# Altium project PT-15-V1.0.PrjPcb (part 6 of 7)

## Sheet 14-RTL8367.schdoc
size A1
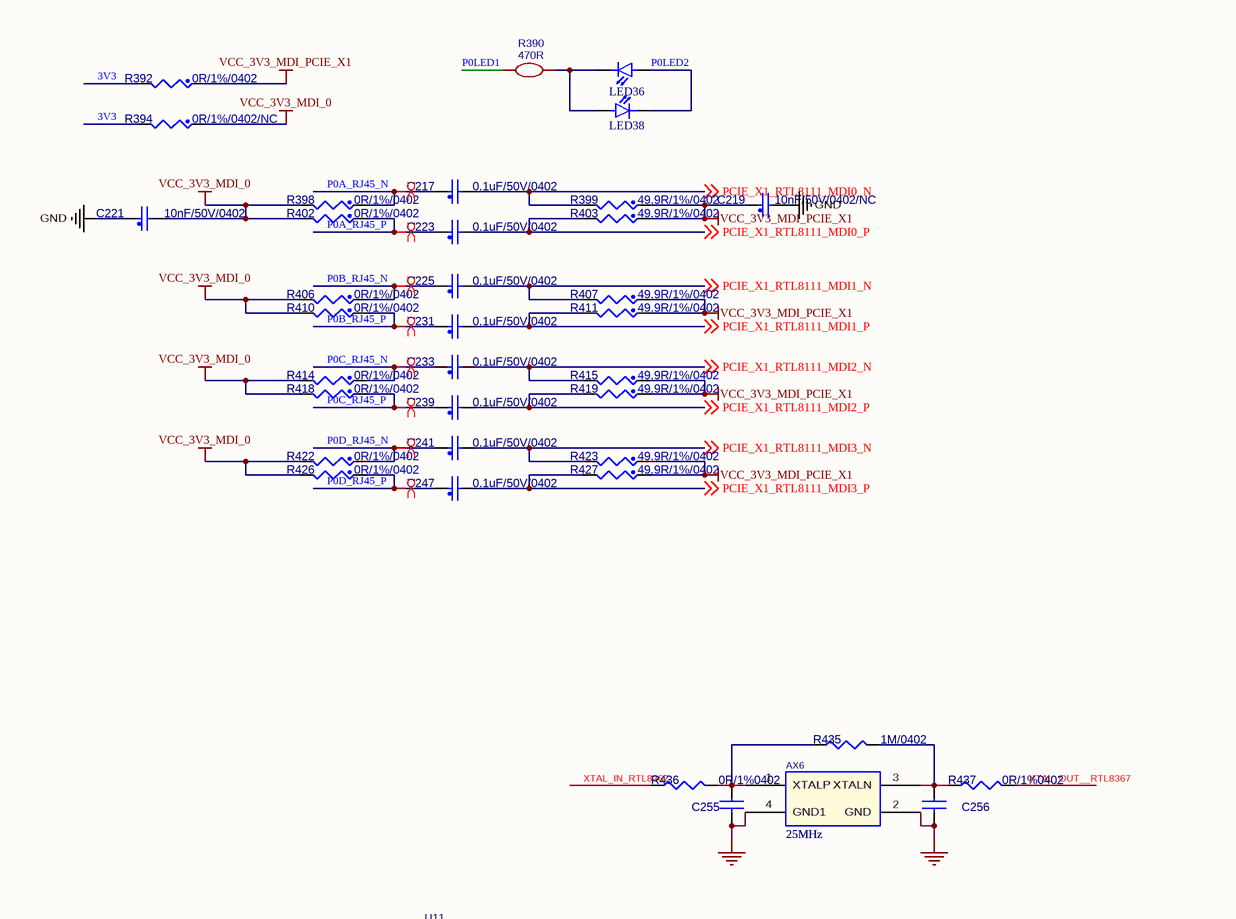
[diagram p20: 14-RTL8367.schdoc, top left]
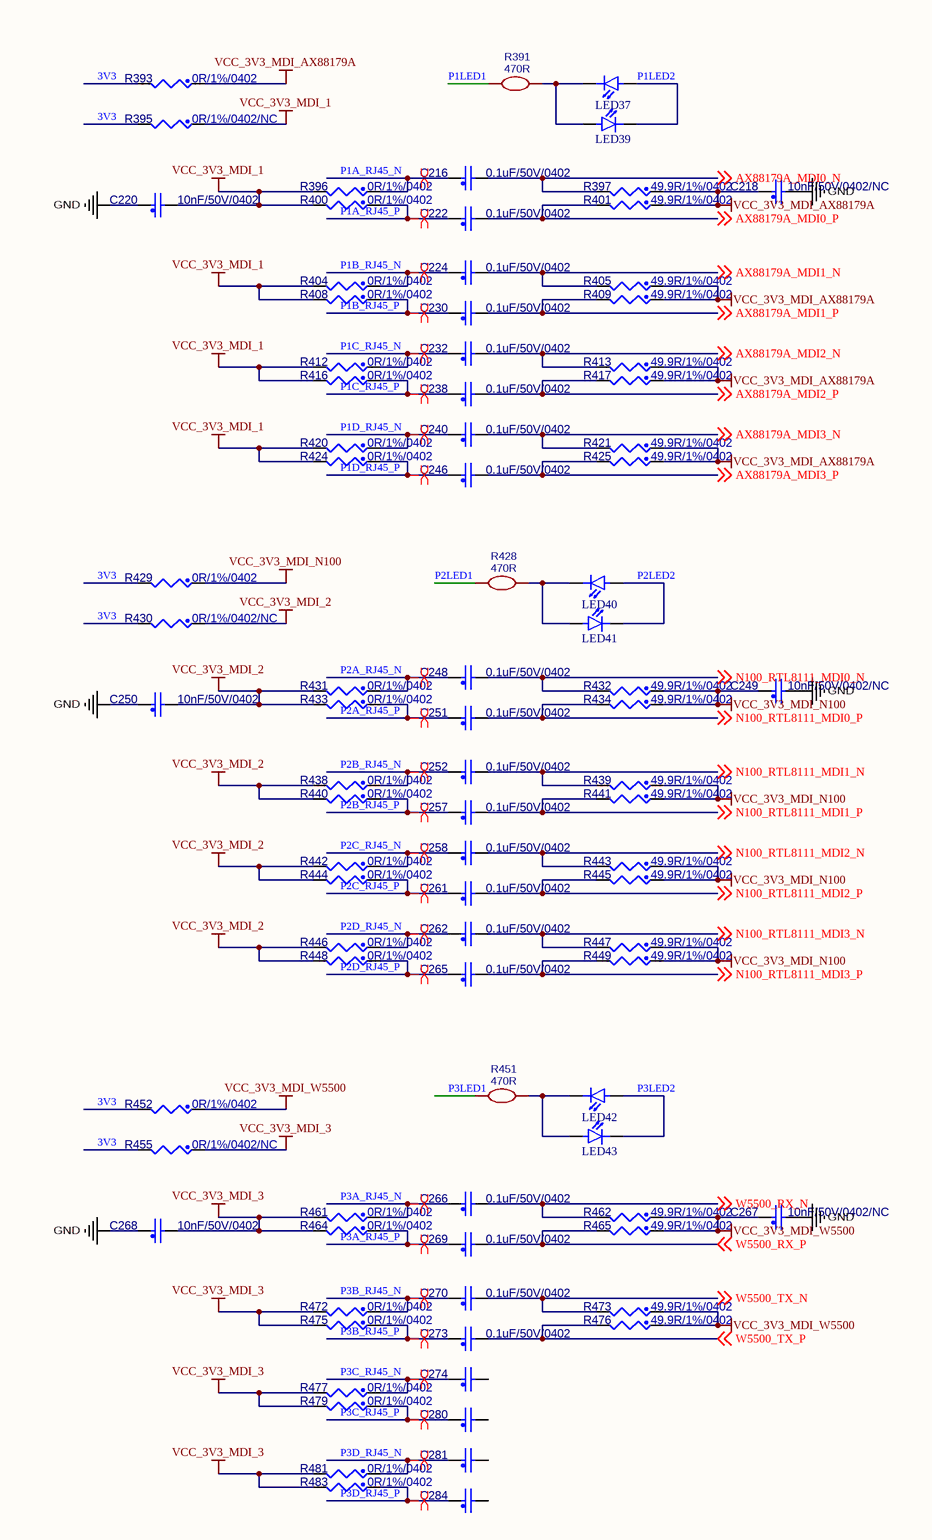
[diagram p21: 14-RTL8367.schdoc, top right]
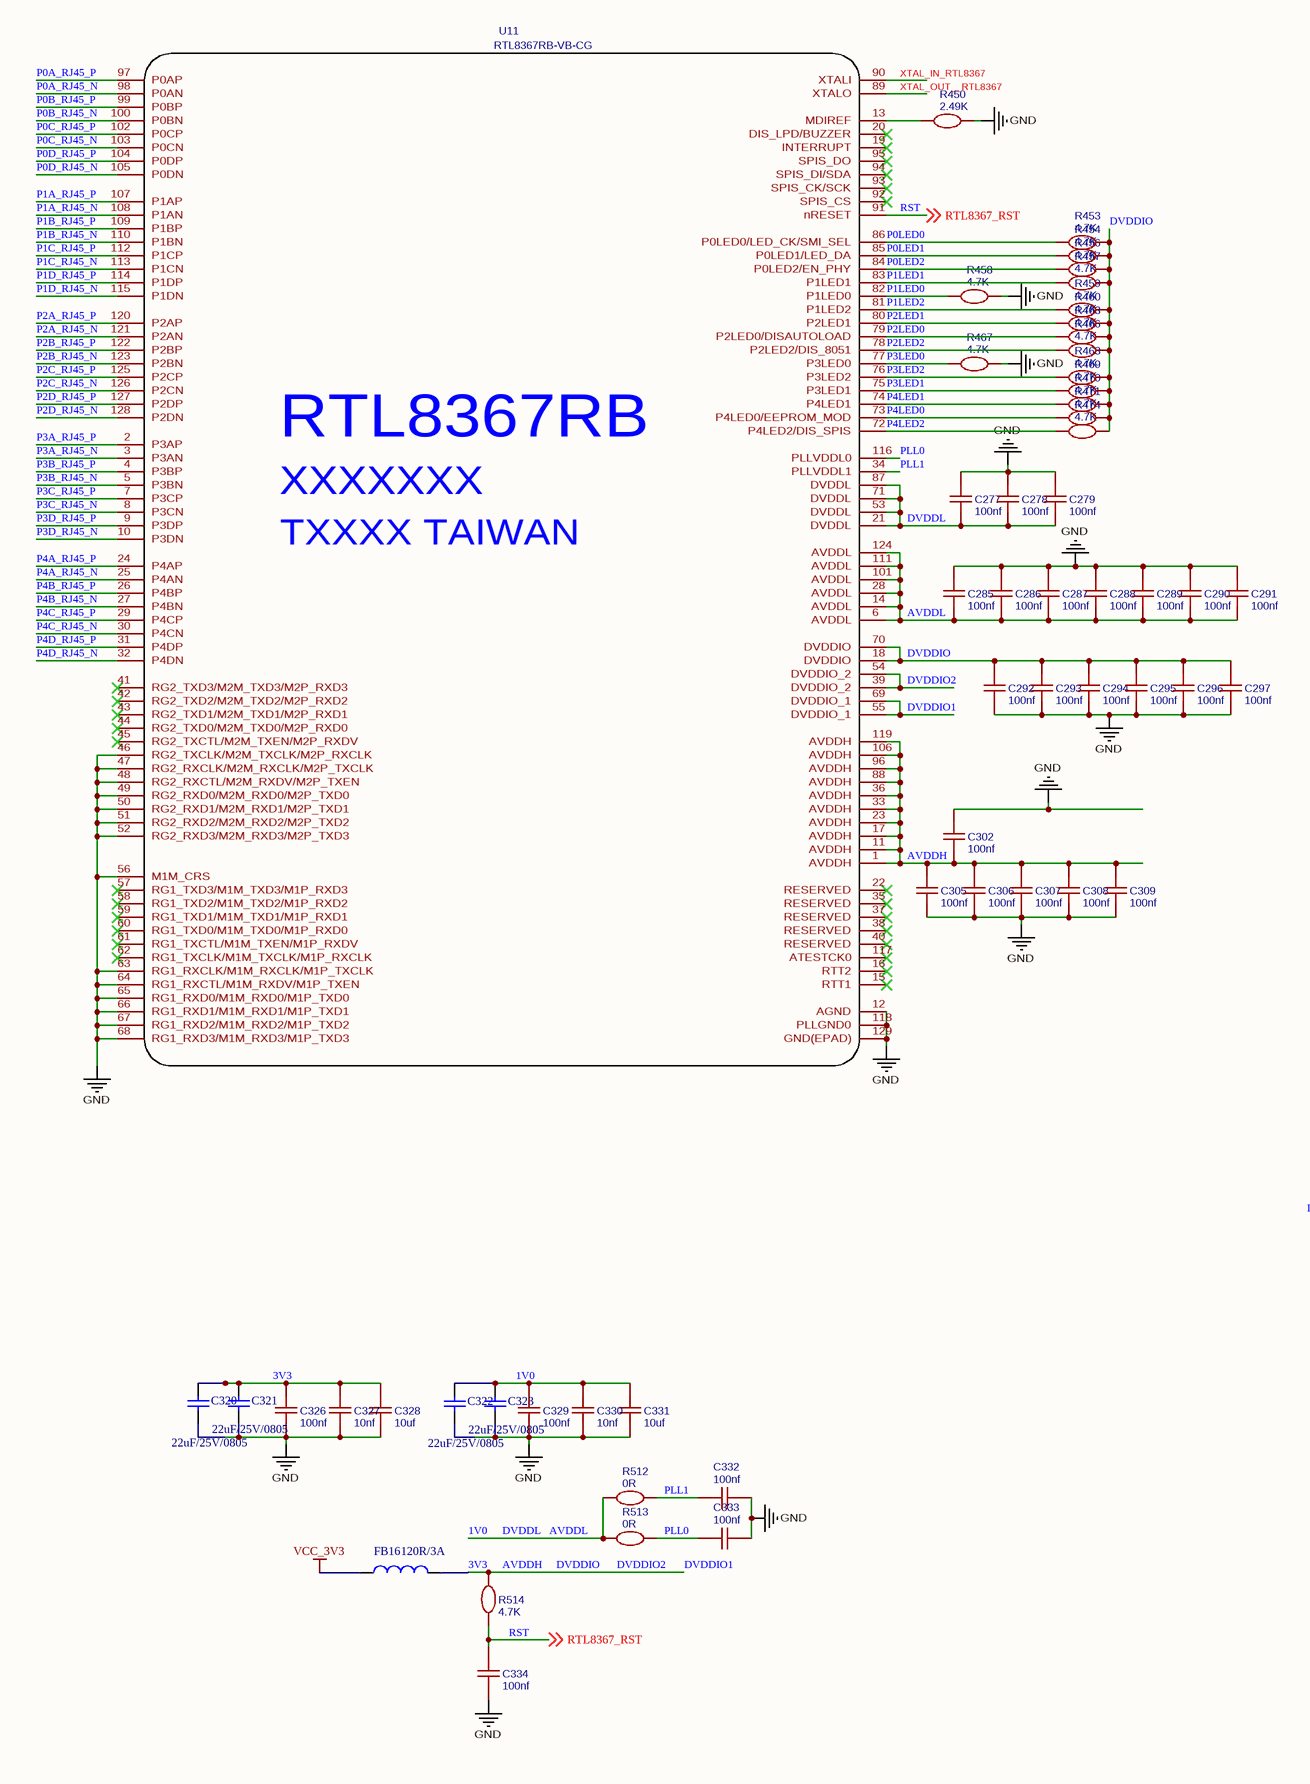
[diagram p22: 14-RTL8367.schdoc, bottom left]
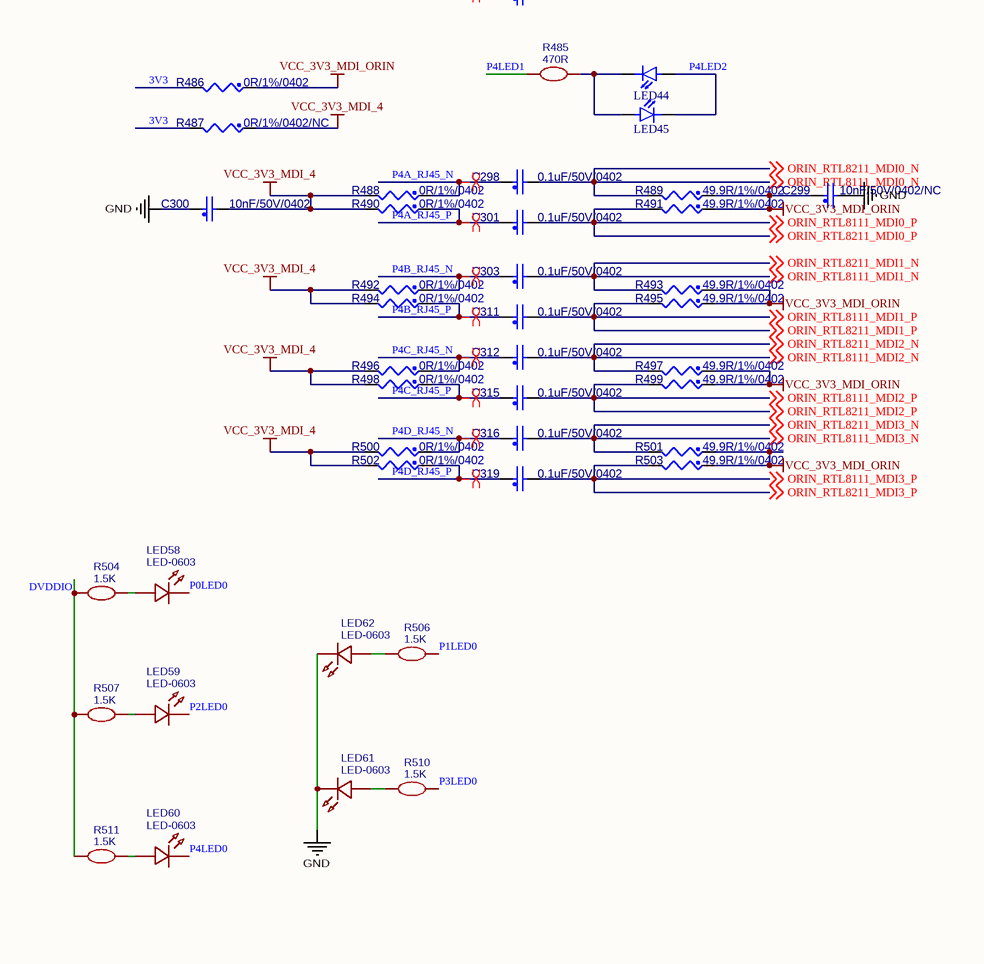
[diagram p23: 14-RTL8367.schdoc, bottom right]

### Parts
(Parts that share a designator on the sheet are numbered #1, #2 ... from top to bottom, then left to right.)
AX6  25MHz  [2016]
C216  value 0.1uF/50V/0402  [C0402]  (hidden comment: CAP_NP)
C217  value 0.1uF/50V/0402  [C0402]  (hidden comment: CAP_NP)
C218  value 10nF/50V/0402/NC  [C0402]  (hidden comment: CAP_NP)
C219  value 10nF/50V/0402/NC  [C0402]  (hidden comment: CAP_NP)
C220  value 10nF/50V/0402  [C0402]  (hidden comment: CAP_NP)
C221  value 10nF/50V/0402  [C0402]  (hidden comment: CAP_NP)
C222  value 0.1uF/50V/0402  [C0402]  (hidden comment: CAP_NP)
C223  value 0.1uF/50V/0402  [C0402]  (hidden comment: CAP_NP)
C224  value 0.1uF/50V/0402  [C0402]  (hidden comment: CAP_NP)
C225  value 0.1uF/50V/0402  [C0402]  (hidden comment: CAP_NP)
C230  value 0.1uF/50V/0402  [C0402]  (hidden comment: CAP_NP)
C231  value 0.1uF/50V/0402  [C0402]  (hidden comment: CAP_NP)
C232  value 0.1uF/50V/0402  [C0402]  (hidden comment: CAP_NP)
C233  value 0.1uF/50V/0402  [C0402]  (hidden comment: CAP_NP)
C238  value 0.1uF/50V/0402  [C0402]  (hidden comment: CAP_NP)
C239  value 0.1uF/50V/0402  [C0402]  (hidden comment: CAP_NP)
C240  value 0.1uF/50V/0402  [C0402]  (hidden comment: CAP_NP)
C241  value 0.1uF/50V/0402  [C0402]  (hidden comment: CAP_NP)
C246  value 0.1uF/50V/0402  [C0402]  (hidden comment: CAP_NP)
C247  value 0.1uF/50V/0402  [C0402]  (hidden comment: CAP_NP)
C248  value 0.1uF/50V/0402  [C0402]  (hidden comment: CAP_NP)
C249  value 10nF/50V/0402/NC  [C0402]  (hidden comment: CAP_NP)
C250  value 10nF/50V/0402  [C0402]  (hidden comment: CAP_NP)
C251  value 0.1uF/50V/0402  [C0402]  (hidden comment: CAP_NP)
C252  value 0.1uF/50V/0402  [C0402]  (hidden comment: CAP_NP)
C255  CAP NP_Dup3  [C0402]  (value not drawn)
C256  CAP NP_Dup3  [C0402]  (value not drawn)
C257  value 0.1uF/50V/0402  [C0402]  (hidden comment: CAP_NP)
C258  value 0.1uF/50V/0402  [C0402]  (hidden comment: CAP_NP)
C261  value 0.1uF/50V/0402  [C0402]  (hidden comment: CAP_NP)
C262  value 0.1uF/50V/0402  [C0402]  (hidden comment: CAP_NP)
C265  value 0.1uF/50V/0402  [C0402]  (hidden comment: CAP_NP)
C266  value 0.1uF/50V/0402  [C0402]  (hidden comment: CAP_NP)
C267  value 10nF/50V/0402/NC  [C0402]  (hidden comment: CAP_NP)
C268  value 10nF/50V/0402  [C0402]  (hidden comment: CAP_NP)
C269  value 0.1uF/50V/0402  [C0402]  (hidden comment: CAP_NP)
C270  value 0.1uF/50V/0402  [C0402]  (hidden comment: CAP_NP)
C273  value 0.1uF/50V/0402  [C0402]  (hidden comment: CAP_NP)
C274  CAP_NP  [C0402]  (value not drawn)
C277  100nf  [C0402]
C278  100nf  [C0402]
C279  100nf  [C0402]
C280  CAP_NP  [C0402]  (value not drawn)
C281  CAP_NP  [C0402]  (value not drawn)
C284  CAP_NP  [C0402]  (value not drawn)
C285  100nf  [C0402]
C286  100nf  [C0402]
C287  100nf  [C0402]
C288  100nf  [C0402]
C289  100nf  [C0402]
C290  100nf  [C0402]
C291  100nf  [C0402]
C292  100nf  [C0402]
C293  100nf  [C0402]
C294  100nf  [C0402]
C295  100nf  [C0402]
C296  100nf  [C0402]
C297  100nf  [C0402]
C298  value 0.1uF/50V/0402  [C0402]  (hidden comment: CAP_NP)
C299  value 10nF/50V/0402/NC  [C0402]  (hidden comment: CAP_NP)
C300  value 10nF/50V/0402  [C0402]  (hidden comment: CAP_NP)
C301  value 0.1uF/50V/0402  [C0402]  (hidden comment: CAP_NP)
C302  100nf  [C0402]
C303  value 0.1uF/50V/0402  [C0402]  (hidden comment: CAP_NP)
C305  100nf  [C0402]
C306  100nf  [C0402]
C307  100nf  [C0402]
C308  100nf  [C0402]
C309  100nf  [C0402]
C311  value 0.1uF/50V/0402  [C0402]  (hidden comment: CAP_NP)
C312  value 0.1uF/50V/0402  [C0402]  (hidden comment: CAP_NP)
C315  value 0.1uF/50V/0402  [C0402]  (hidden comment: CAP_NP)
C316  value 0.1uF/50V/0402  [C0402]  (hidden comment: CAP_NP)
C319  value 0.1uF/50V/0402  [C0402]  (hidden comment: CAP_NP)
C320  22uF/25V/0805  [C0805]
C321  22uF/25V/0805  [C0805]
C322  22uF/25V/0805  [C0805]
C323  22uF/25V/0805  [C0805]
C326  100nf  [C0402]
C327  10nf  [C0402]
C328  10uf  [C0805]
C329  100nf  [C0402]
C330  10nf  [C0402]
C331  10uf  [C0805]
C332  100nf  [C0402]
C333  100nf  [C0402]
C334  100nf  [C0402]
FB16  120R/3A  [L0603]
LED36  LED_GREEN  [LED0603]  (value not drawn)
LED37  LED_GREEN  [LED0603]  (value not drawn)
LED38  LED_GREEN  [LED0603]  (value not drawn)
LED39  LED_GREEN  [LED0603]  (value not drawn)
LED40  LED_GREEN  [LED0603]  (value not drawn)
LED41  LED_GREEN  [LED0603]  (value not drawn)
LED42  LED_GREEN  [LED0603]  (value not drawn)
LED43  LED_GREEN  [LED0603]  (value not drawn)
LED44  LED_GREEN  [LED0603]  (value not drawn)
LED45  LED_GREEN  [LED0603]  (value not drawn)
LED58  LED-0603  [LED0603]
LED59  LED-0603  [LED0603]
LED60  LED-0603  [LED0603]
LED61  LED-0603  [LED0603]
LED62#1  LED-0603  [LED0603]
R390  470R  [R0402]
R391  470R  [R0402]
R392  value 0R/1%/0402  [R0402]  (hidden comment: RES_Dup2)
R393  value 0R/1%/0402  [R0402]  (hidden comment: RES_Dup2)
R394  value 0R/1%/0402/NC  [R0402]  (hidden comment: RES_Dup2)
R395  value 0R/1%/0402/NC  [R0402]  (hidden comment: RES_Dup2)
R396  value 0R/1%/0402  [R0402]  (hidden comment: RES_Dup2)
R397  value 49.9R/1%/0402  [R0402]  (hidden comment: RES_Dup2)
R398  value 0R/1%/0402  [R0402]  (hidden comment: RES_Dup2)
R399  value 49.9R/1%/0402  [R0402]  (hidden comment: RES_Dup2)
R400  value 0R/1%/0402  [R0402]  (hidden comment: RES_Dup2)
R401  value 49.9R/1%/0402  [R0402]  (hidden comment: RES_Dup2)
R402  value 0R/1%/0402  [R0402]  (hidden comment: RES_Dup2)
R403  value 49.9R/1%/0402  [R0402]  (hidden comment: RES_Dup2)
R404  value 0R/1%/0402  [R0402]  (hidden comment: RES_Dup2)
R405  value 49.9R/1%/0402  [R0402]  (hidden comment: RES_Dup2)
R406  value 0R/1%/0402  [R0402]  (hidden comment: RES_Dup2)
R407  value 49.9R/1%/0402  [R0402]  (hidden comment: RES_Dup2)
R408  value 0R/1%/0402  [R0402]  (hidden comment: RES_Dup2)
R409  value 49.9R/1%/0402  [R0402]  (hidden comment: RES_Dup2)
R410  value 0R/1%/0402  [R0402]  (hidden comment: RES_Dup2)
R411  value 49.9R/1%/0402  [R0402]  (hidden comment: RES_Dup2)
R412  value 0R/1%/0402  [R0402]  (hidden comment: RES_Dup2)
R413  value 49.9R/1%/0402  [R0402]  (hidden comment: RES_Dup2)
R414  value 0R/1%/0402  [R0402]  (hidden comment: RES_Dup2)
R415  value 49.9R/1%/0402  [R0402]  (hidden comment: RES_Dup2)
R416  value 0R/1%/0402  [R0402]  (hidden comment: RES_Dup2)
R417  value 49.9R/1%/0402  [R0402]  (hidden comment: RES_Dup2)
R418  value 0R/1%/0402  [R0402]  (hidden comment: RES_Dup2)
R419  value 49.9R/1%/0402  [R0402]  (hidden comment: RES_Dup2)
R420  value 0R/1%/0402  [R0402]  (hidden comment: RES_Dup2)
R421  value 49.9R/1%/0402  [R0402]  (hidden comment: RES_Dup2)
R422  value 0R/1%/0402  [R0402]  (hidden comment: RES_Dup2)
R423  value 49.9R/1%/0402  [R0402]  (hidden comment: RES_Dup2)
R424  value 0R/1%/0402  [R0402]  (hidden comment: RES_Dup2)
R425  value 49.9R/1%/0402  [R0402]  (hidden comment: RES_Dup2)
R426  value 0R/1%/0402  [R0402]  (hidden comment: RES_Dup2)
R427  value 49.9R/1%/0402  [R0402]  (hidden comment: RES_Dup2)
R428  470R  [R0402]
R429  value 0R/1%/0402  [R0402]  (hidden comment: RES_Dup2)
R430  value 0R/1%/0402/NC  [R0402]  (hidden comment: RES_Dup2)
R431  value 0R/1%/0402  [R0402]  (hidden comment: RES_Dup2)
R432  value 49.9R/1%/0402  [R0402]  (hidden comment: RES_Dup2)
R433  value 0R/1%/0402  [R0402]  (hidden comment: RES_Dup2)
R434  value 49.9R/1%/0402  [R0402]  (hidden comment: RES_Dup2)
R435  value 1M/0402  [R0402]  (hidden comment: R_Dup3)
R436  value 0R/1%0402  [R0402]  (hidden comment: R_Dup3)
R437  value 0R/1%0402  [R0402]  (hidden comment: R_Dup3)
R438  value 0R/1%/0402  [R0402]  (hidden comment: RES_Dup2)
R439  value 49.9R/1%/0402  [R0402]  (hidden comment: RES_Dup2)
R440  value 0R/1%/0402  [R0402]  (hidden comment: RES_Dup2)
R441  value 49.9R/1%/0402  [R0402]  (hidden comment: RES_Dup2)
R442  value 0R/1%/0402  [R0402]  (hidden comment: RES_Dup2)
R443  value 49.9R/1%/0402  [R0402]  (hidden comment: RES_Dup2)
R444  value 0R/1%/0402  [R0402]  (hidden comment: RES_Dup2)
R445  value 49.9R/1%/0402  [R0402]  (hidden comment: RES_Dup2)
R446  value 0R/1%/0402  [R0402]  (hidden comment: RES_Dup2)
R447  value 49.9R/1%/0402  [R0402]  (hidden comment: RES_Dup2)
R448  value 0R/1%/0402  [R0402]  (hidden comment: RES_Dup2)
R449  value 49.9R/1%/0402  [R0402]  (hidden comment: RES_Dup2)
R450  2.49K  [R0402]
R451  470R  [R0402]
R452  value 0R/1%/0402  [R0402]  (hidden comment: RES_Dup2)
R453  4.7K  [R0402]
R454  4.7K  [R0402]
R455  value 0R/1%/0402/NC  [R0402]  (hidden comment: RES_Dup2)
R456  4.7K  [R0402]
R457  4.7K  [R0402]
R458  4.7K  [R0402]
R459  4.7K  [R0402]
R460  4.7K  [R0402]
R461  value 0R/1%/0402  [R0402]  (hidden comment: RES_Dup2)
R462  value 49.9R/1%/0402  [R0402]  (hidden comment: RES_Dup2)
R463  4.7K  [R0402]
R464  value 0R/1%/0402  [R0402]  (hidden comment: RES_Dup2)
R465  value 49.9R/1%/0402  [R0402]  (hidden comment: RES_Dup2)
R466  4.7K  [R0402]
R467  4.7K  [R0402]
R468  4.7K  [R0402]
R469  4.7K  [R0402]
R470  4.7K  [R0402]
R471  4.7K  [R0402]
R472  value 0R/1%/0402  [R0402]  (hidden comment: RES_Dup2)
R473  value 49.9R/1%/0402  [R0402]  (hidden comment: RES_Dup2)
R474  4.7K  [R0402]
R475  value 0R/1%/0402  [R0402]  (hidden comment: RES_Dup2)
R476  value 49.9R/1%/0402  [R0402]  (hidden comment: RES_Dup2)
R477  value 0R/1%/0402  [R0402]  (hidden comment: RES_Dup2)
R479  value 0R/1%/0402  [R0402]  (hidden comment: RES_Dup2)
R481  value 0R/1%/0402  [R0402]  (hidden comment: RES_Dup2)
R483  value 0R/1%/0402  [R0402]  (hidden comment: RES_Dup2)
R485  470R  [R0402]
R486  value 0R/1%/0402  [R0402]  (hidden comment: RES_Dup2)
R487  value 0R/1%/0402/NC  [R0402]  (hidden comment: RES_Dup2)
R488  value 0R/1%/0402  [R0402]  (hidden comment: RES_Dup2)
R489  value 49.9R/1%/0402  [R0402]  (hidden comment: RES_Dup2)
R490  value 0R/1%/0402  [R0402]  (hidden comment: RES_Dup2)
R491  value 49.9R/1%/0402  [R0402]  (hidden comment: RES_Dup2)
R492  value 0R/1%/0402  [R0402]  (hidden comment: RES_Dup2)
R493  value 49.9R/1%/0402  [R0402]  (hidden comment: RES_Dup2)
R494  value 0R/1%/0402  [R0402]  (hidden comment: RES_Dup2)
R495  value 49.9R/1%/0402  [R0402]  (hidden comment: RES_Dup2)
R496  value 0R/1%/0402  [R0402]  (hidden comment: RES_Dup2)
R497  value 49.9R/1%/0402  [R0402]  (hidden comment: RES_Dup2)
R498  value 0R/1%/0402  [R0402]  (hidden comment: RES_Dup2)
R499  value 49.9R/1%/0402  [R0402]  (hidden comment: RES_Dup2)
R500  value 0R/1%/0402  [R0402]  (hidden comment: RES_Dup2)
R501  value 49.9R/1%/0402  [R0402]  (hidden comment: RES_Dup2)
R502  value 0R/1%/0402  [R0402]  (hidden comment: RES_Dup2)
R503  value 49.9R/1%/0402  [R0402]  (hidden comment: RES_Dup2)
R504  1.5K  [R0402]
R506  1.5K  [R0402]
R507  1.5K  [R0402]
R510  1.5K  [R0402]
R511  1.5K  [R0402]
R512  0R  [R0402]
R513  0R  [R0402]
R514  4.7K  [R0402]
U11  RTL8367RB-VB-CG  [RTL8367RB_LQFP128]

### Nets
GND: AX6.2(GND) AX6.4(GND1) C218.2 C219.2 C220.1 C221.1 C249.2 C250.1 C255.2 C256.2 C267.2 C268.1 C277.1 C278.1 C279.1 C285.1 C286.1 C287.1 C288.1 C289.1 C290.1 C291.1 C292.2 C293.2 C294.2 C295.2 C296.2 C297.2 C299.2 C300.1 C302.1 C305.2 C306.2 C307.2 C308.2 C309.2 C320.1 C321.1 C322.1 C323.1 C326.2 C327.2 C328.2 C329.2 C330.2 C331.2 C332.2 C333.2 C334.2 LED61.2 LED62#1.2 R450.2 R458.2 R467.2 U11.12(AGND) U11.46(RG2_TXCLK/M2M_TXCLK/M2P_RXCLK) U11.47(RG2_RXCLK/M2M_RXCLK/M2P_TXCLK) U11.48(RG2_RXCTL/M2M_RXDV/M2P_TXEN) U11.49(RG2_RXD0/M2M_RXD0/M2P_TXD0) U11.50(RG2_RXD1/M2M_RXD1/M2P_TXD1) U11.51(RG2_RXD2/M2M_RXD2/M2P_TXD2) U11.52(RG2_RXD3/M2M_RXD3/M2P_TXD3) U11.56(M1M_CRS) U11.63(RG1_RXCLK/M1M_RXCLK/M1P_TXCLK) U11.64(RG1_RXCTL/M1M_RXDV/M1P_TXEN) U11.65(RG1_RXD0/M1M_RXD0/M1P_TXD0) U11.66(RG1_RXD1/M1M_RXD1/M1P_TXD1) U11.67(RG1_RXD2/M1M_RXD2/M1P_TXD2) U11.68(RG1_RXD3/M1M_RXD3/M1P_TXD3) U11.118(PLLGND0) U11.129(GND(EPAD))
VCC_3V3: FB16.1  [project net 3V3_ORIN_F1]
VCC_3V3_MDI_0: C221.2 R394.1 R398.2 R402.2 R406.2 R410.2 R414.2 R418.2 R422.2 R426.2
VCC_3V3_MDI_1: C220.2 R395.1 R396.2 R400.2 R404.2 R408.2 R412.2 R416.2 R420.2 R424.2
VCC_3V3_MDI_2: C250.2 R430.1 R431.2 R433.2 R438.2 R440.2 R442.2 R444.2 R446.2 R448.2
VCC_3V3_MDI_3: C268.2 R455.1 R461.2 R464.2 R472.2 R475.2 R477.2 R479.2 R481.2 R483.2
VCC_3V3_MDI_4: C300.2 R487.1 R488.2 R490.2 R492.2 R494.2 R496.2 R498.2 R500.2 R502.2
VCC_3V3_MDI_AX88179A: C218.1 R393.1 R397.1 R401.1 R405.1 R409.1 R413.1 R417.1 R421.1 R425.1
VCC_3V3_MDI_N100: C249.1 R429.1 R432.1 R434.1 R439.1 R441.1 R443.1 R445.1 R447.1 R449.1
VCC_3V3_MDI_ORIN: C299.1 R486.1 R489.1 R491.1 R493.1 R495.1 R497.1 R499.1 R501.1 R503.1
VCC_3V3_MDI_PCIE_X1: C219.1 R392.1 R399.1 R403.1 R407.1 R411.1 R415.1 R419.1 R423.1 R427.1
VCC_3V3_MDI_W5500: C267.1 R452.1 R462.1 R465.1 R473.1 R476.1
1V0: C277.2 C278.2 C279.2 C285.2 C286.2 C287.2 C288.2 C289.2 C290.2 C291.2 C322.2 C323.2 C329.1 C330.1 C331.1 R512.1 R513.1 U11.6(AVDDL) U11.14(AVDDL) U11.21(DVDDL) U11.28(AVDDL) U11.53(DVDDL) U11.71(DVDDL) U11.87(DVDDL) U11.101(AVDDL) U11.111(AVDDL) U11.124(AVDDL)  [also labelled AVDDL, DVDDL]
3V3: C292.1 C293.1 C294.1 C295.1 C296.1 C297.1 C302.2 C305.1 C306.1 C307.1 C308.1 C309.1 C320.2 C321.2 C326.1 C327.1 C328.1 FB16.2 R392.2 R393.2 R394.2 R395.2 R429.2 R430.2 R452.2 R453.2 R454.2 R455.2 R456.2 R457.2 R459.2 R460.2 R463.2 R466.2 R468.2 R469.2 R470.2 R471.2 R474.2 R486.2 R487.2 R504.1 R507.1 R511.1 R514.2 U11.1(AVDDH) U11.11(AVDDH) U11.17(AVDDH) U11.18(DVDDIO) U11.23(AVDDH) U11.33(AVDDH) U11.36(AVDDH) U11.39(DVDDIO_2) U11.54(DVDDIO_2) U11.55(DVDDIO_1) U11.69(DVDDIO_1) U11.70(DVDDIO) U11.88(AVDDH) U11.96(AVDDH) U11.106(AVDDH) U11.119(AVDDH)  [also labelled AVDDH, DVDDIO, DVDDIO1, DVDDIO2]
AX88179A_MDI0_N: C216.2 R397.2 ; off-sheet AX88179A_MDI0_N
AX88179A_MDI0_P: C222.2 R401.2 ; off-sheet AX88179A_MDI0_P
AX88179A_MDI1_N: C224.2 R405.2 ; off-sheet AX88179A_MDI1_N
AX88179A_MDI1_P: C230.2 R409.2 ; off-sheet AX88179A_MDI1_P
AX88179A_MDI2_N: C232.2 R413.2 ; off-sheet AX88179A_MDI2_N
AX88179A_MDI2_P: C238.2 R417.2 ; off-sheet AX88179A_MDI2_P
AX88179A_MDI3_N: C240.2 R421.2 ; off-sheet AX88179A_MDI3_N
AX88179A_MDI3_P: C246.2 R425.2 ; off-sheet AX88179A_MDI3_P
N100_RTL8111_MDI0_N: C248.2 R432.2 ; off-sheet N100_RTL8111_MDI0_N
N100_RTL8111_MDI0_P: C251.2 R434.2 ; off-sheet N100_RTL8111_MDI0_P
N100_RTL8111_MDI1_N: C252.2 R439.2 ; off-sheet N100_RTL8111_MDI1_N
N100_RTL8111_MDI1_P: C257.2 R441.2 ; off-sheet N100_RTL8111_MDI1_P
N100_RTL8111_MDI2_N: C258.2 R443.2 ; off-sheet N100_RTL8111_MDI2_N
N100_RTL8111_MDI2_P: C261.2 R445.2 ; off-sheet N100_RTL8111_MDI2_P
N100_RTL8111_MDI3_N: C262.2 R447.2 ; off-sheet N100_RTL8111_MDI3_N
N100_RTL8111_MDI3_P: C265.2 R449.2 ; off-sheet N100_RTL8111_MDI3_P
ORIN_RTL8111_MDI0_N: C298.2 R489.2 ; off-sheet ORIN_RTL8211_MDI0_N, off-sheet ORIN_RTL8111_MDI0_N  [also labelled ORIN_RTL8211_MDI0_N]
ORIN_RTL8111_MDI0_P: C301.2 R491.2 ; off-sheet ORIN_RTL8211_MDI0_P, off-sheet ORIN_RTL8111_MDI0_P  [also labelled ORIN_RTL8211_MDI0_P]
ORIN_RTL8111_MDI1_N: C303.2 R493.2 ; off-sheet ORIN_RTL8211_MDI1_N, off-sheet ORIN_RTL8111_MDI1_N  [also labelled ORIN_RTL8211_MDI1_N]
ORIN_RTL8111_MDI1_P: C311.2 R495.2 ; off-sheet ORIN_RTL8211_MDI1_P, off-sheet ORIN_RTL8111_MDI1_P  [also labelled ORIN_RTL8211_MDI1_P]
ORIN_RTL8111_MDI2_N: C312.2 R497.2 ; off-sheet ORIN_RTL8211_MDI2_N, off-sheet ORIN_RTL8111_MDI2_N  [also labelled ORIN_RTL8211_MDI2_N]
ORIN_RTL8111_MDI2_P: C315.2 R499.2 ; off-sheet ORIN_RTL8211_MDI2_P, off-sheet ORIN_RTL8111_MDI2_P  [also labelled ORIN_RTL8211_MDI2_P]
ORIN_RTL8111_MDI3_N: C316.2 R501.2 ; off-sheet ORIN_RTL8211_MDI3_N, off-sheet ORIN_RTL8111_MDI3_N  [also labelled ORIN_RTL8211_MDI3_N]
ORIN_RTL8111_MDI3_P: C319.2 R503.2 ; off-sheet ORIN_RTL8211_MDI3_P, off-sheet ORIN_RTL8111_MDI3_P  [also labelled ORIN_RTL8211_MDI3_P]
P0A_RJ45_N: C217.1 R398.1 U11.98(P0AN)
P0A_RJ45_P: C223.1 R402.1 U11.97(P0AP)
P0B_RJ45_N: C225.1 R406.1 U11.100(P0BN)
P0B_RJ45_P: C231.1 R410.1 U11.99(P0BP)
P0C_RJ45_N: C233.1 R414.1 U11.103(P0CN)
P0C_RJ45_P: C239.1 R418.1 U11.102(P0CP)
P0D_RJ45_N: C241.1 R422.1 U11.105(P0DN)
P0D_RJ45_P: C247.1 R426.1 U11.104(P0DP)
P0LED0: LED58.2 R453.1 U11.86(P0LED0/LED_CK/SMI_SEL)
P0LED1: R390.1 R454.1 U11.85(P0LED1/LED_DA)
P0LED2: LED36.1 LED38.2 R456.1 U11.84(P0LED2/EN_PHY)
P1A_RJ45_N: C216.1 R396.1 U11.108(P1AN)
P1A_RJ45_P: C222.1 R400.1 U11.107(P1AP)
P1B_RJ45_N: C224.1 R404.1 U11.110(P1BN)
P1B_RJ45_P: C230.1 R408.1 U11.109(P1BP)
P1C_RJ45_N: C232.1 R412.1 U11.113(P1CN)
P1C_RJ45_P: C238.1 R416.1 U11.112(P1CP)
P1D_RJ45_N: C240.1 R420.1 U11.115(P1DN)
P1D_RJ45_P: C246.1 R424.1 U11.114(P1DP)
P1LED0: R458.1 R506.2 U11.82(P1LED0)
P1LED1: R391.1 R457.1 U11.83(P1LED1)
P1LED2: LED37.1 LED39.2 R459.1 U11.81(P1LED2)
P2A_RJ45_N: C248.1 R431.1 U11.121(P2AN)
P2A_RJ45_P: C251.1 R433.1 U11.120(P2AP)
P2B_RJ45_N: C252.1 R438.1 U11.123(P2BN)
P2B_RJ45_P: C257.1 R440.1 U11.122(P2BP)
P2C_RJ45_N: C258.1 R442.1 U11.126(P2CN)
P2C_RJ45_P: C261.1 R444.1 U11.125(P2CP)
P2D_RJ45_N: C262.1 R446.1 U11.128(P2DN)
P2D_RJ45_P: C265.1 R448.1 U11.127(P2DP)
P2LED0: LED59.2 R463.1 U11.79(P2LED0/DISAUTOLOAD)
P2LED1: R428.1 R460.1 U11.80(P2LED1)
P2LED2: LED40.1 LED41.2 R466.1 U11.78(P2LED2/DIS_8051)
P3A_RJ45_N: C266.1 R461.1 U11.3(P3AN)
P3A_RJ45_P: C269.1 R464.1 U11.2(P3AP)
P3B_RJ45_N: C270.1 R472.1 U11.5(P3BN)
P3B_RJ45_P: C273.1 R475.1 U11.4(P3BP)
P3C_RJ45_N: C274.1 R477.1 U11.8(P3CN)
P3C_RJ45_P: C280.1 R479.1 U11.7(P3CP)
P3D_RJ45_N: C281.1 R481.1 U11.10(P3DN)
P3D_RJ45_P: C284.1 R483.1 U11.9(P3DP)
P3LED0: R467.1 R510.2 U11.77(P3LED0)
P3LED1: R451.1 R469.1 U11.75(P3LED1)
P3LED2: LED42.1 LED43.2 R468.1 U11.76(P3LED2)
P4A_RJ45_N: C298.1 R488.1 U11.25(P4AN)
P4A_RJ45_P: C301.1 R490.1 U11.24(P4AP)
P4B_RJ45_N: C303.1 R492.1 U11.27(P4BN)
P4B_RJ45_P: C311.1 R494.1 U11.26(P4BP)
P4C_RJ45_N: C312.1 R496.1 U11.30(P4CN)
P4C_RJ45_P: C315.1 R498.1 U11.29(P4CP)
P4D_RJ45_N: C316.1 R500.1 U11.32(P4DN)
P4D_RJ45_P: C319.1 R502.1 U11.31(P4DP)
P4LED0: LED60.2 R471.1 U11.73(P4LED0/EEPROM_MOD)
P4LED1: R470.1 R485.1 U11.74(P4LED1)
P4LED2: LED44.1 LED45.2 R474.1 U11.72(P4LED2/DIS_SPIS)
PCIE_X1_RTL8111_MDI0_N: C217.2 R399.2 ; off-sheet PCIE_X1_RTL8111_MDI0_N
PCIE_X1_RTL8111_MDI0_P: C223.2 R403.2 ; off-sheet PCIE_X1_RTL8111_MDI0_P
PCIE_X1_RTL8111_MDI1_N: C225.2 R407.2 ; off-sheet PCIE_X1_RTL8111_MDI1_N
PCIE_X1_RTL8111_MDI1_P: C231.2 R411.2 ; off-sheet PCIE_X1_RTL8111_MDI1_P
PCIE_X1_RTL8111_MDI2_N: C233.2 R415.2 ; off-sheet PCIE_X1_RTL8111_MDI2_N
PCIE_X1_RTL8111_MDI2_P: C239.2 R419.2 ; off-sheet PCIE_X1_RTL8111_MDI2_P
PCIE_X1_RTL8111_MDI3_N: C241.2 R423.2 ; off-sheet PCIE_X1_RTL8111_MDI3_N
PCIE_X1_RTL8111_MDI3_P: C247.2 R427.2 ; off-sheet PCIE_X1_RTL8111_MDI3_P
PLL0: C333.1 R513.2 U11.116(PLLVDDL0)
PLL1: C332.1 R512.2 U11.34(PLLVDDL1)
RST: C334.1 R514.1 U11.91(nRESET) ; off-sheet RTL8367_RST  [also labelled RTL8367_RST]
W5500_RX_N: C266.2 R462.2 ; off-sheet W5500_RX_N
W5500_RX_P: C269.2 R465.2 ; off-sheet W5500_RX_P
W5500_TX_N: C270.2 R473.2 ; off-sheet W5500_TX_N
W5500_TX_P: C273.2 R476.2 ; off-sheet W5500_TX_P
XTAL_IN_RTL8367: R436.1 U11.90(XTALI)
XTAL_OUT__RTL8367: R437.2 U11.89(XTALO)
NetAX6_1: AX6.1(XTALP) C255.1 R435.1 R436.2
NetAX6_3: AX6.3(XTALN) C256.1 R435.2 R437.1
NetLED36_2: LED36.2 LED38.1 R390.2
NetLED37_2: LED37.2 LED39.1 R391.2
NetLED40_2: LED40.2 LED41.1 R428.2
NetLED42_2: LED42.2 LED43.1 R451.2
NetLED44_2: LED44.2 LED45.1 R485.2
NetLED58_1: LED58.1 R504.2
NetLED59_1: LED59.1 R507.2
NetLED60_1: LED60.1 R511.2
NetLED61_1: LED61.1 R510.1
NetLED62#1_1: LED62#1.1 R506.1
NetR450_1: R450.1 U11.13(MDIREF)

Not connected (* = marked no-connect by the designer): C274 2; C280 2; C281 2; C284 2; U11 15(RTT1)* 16(RTT2)* 19(INTERRUPT)* 20(DIS_LPD/BUZZER)* 22(RESERVED)* 35(RESERVED)* 37(RESERVED)* 38(RESERVED)* 40(RESERVED)* 41(RG2_TXD3/M2M_TXD3/M2P_RXD3)* 42(RG2_TXD2/M2M_TXD2/M2P_RXD2)* 43(RG2_TXD1/M2M_TXD1/M2P_RXD1)* 44(RG2_TXD0/M2M_TXD0/M2P_RXD0)* 45(RG2_TXCTL/M2M_TXEN/M2P_RXDV)* 57(RG1_TXD3/M1M_TXD3/M1P_RXD3)* 58(RG1_TXD2/M1M_TXD2/M1P_RXD2)* 59(RG1_TXD1/M1M_TXD1/M1P_RXD1)* 60(RG1_TXD0/M1M_TXD0/M1P_RXD0)* 61(RG1_TXCTL/M1M_TXEN/M1P_RXDV)* 62(RG1_TXCLK/M1M_TXCLK/M1P_RXCLK)* 92(SPIS_CS)* 93(SPIS_CK/SCK)* 94(SPIS_DI/SDA)* 95(SPIS_DO)* 117(ATESTCK0)*

### Layout directives
differential pair: P0A_RJ45_N, P0A_RJ45_P, P0B_RJ45_N, P0B_RJ45_P, P0C_RJ45_N, P0C_RJ45_P, P0D_RJ45_N, P0D_RJ45_P, P1A_RJ45_N, P1A_RJ45_P, P1B_RJ45_N, P1B_RJ45_P, P1C_RJ45_N, P1C_RJ45_P, P1D_RJ45_N, P1D_RJ45_P, P2A_RJ45_N, P2A_RJ45_P, P2B_RJ45_N, P2B_RJ45_P, P2C_RJ45_N, P2C_RJ45_P, P2D_RJ45_N, P2D_RJ45_P, P3A_RJ45_N, P3A_RJ45_P, P3B_RJ45_N, P3B_RJ45_P, P3C_RJ45_N, P3C_RJ45_P, P3D_RJ45_N, P3D_RJ45_P, P4A_RJ45_N, P4A_RJ45_P, P4B_RJ45_N, P4B_RJ45_P, P4C_RJ45_N, P4C_RJ45_P, P4D_RJ45_N, P4D_RJ45_P

### Notes on the sheet
- (in symbol RTL8367RB-VB-CG) RTL8367RB; XXXXXXX; TXXXX TAIWAN

### Library data of the parts
AX6 = XTAL_0: Part Reference: AX3; PCB Footprint: CRY5032; Value: 25MHz
C216-C225 C230-C233 C238-C241 C246-C252 C257 C258 C261 C262 C265-C270 C273 C274 C280 C281 C284 C298-C301 C303 C311 C312 C315 C316 C319 = CAP_NP: GCM155R71H104KE02/MURATA; Part Reference: C15; CLASS: DISCRETE; FPLIST: CC0402_25,CC0402_HD,CC0402_CC; CAD_APPROVED: Yes; MFG_PN01: 0402YC104KAT2A; MFG_NAME01: AVX; Tolerance: 10%; AGILE_PN: 150-75182; VOLTAGE: 16V; HEIGHT: 0.635MM; ROHS: Yes; TOL: 10%; PCB Footprint: C0402
C255 = CAP NP_Dup3: Part Reference: C71; Value: 20pF/50V X7R; PCB Footprint: C0402
C256 = CAP NP_Dup3: Part Reference: C72; Value: 20pF/50V X7R; PCB Footprint: C0402
C277-C279 C285-C297 C302 C305-C309 C326 C329 C332-C334 = 100nf: nameAlias: Value(F); Contributor: LCEDA_Lib; spicePre: C; spiceSymbolName: C_0201_US
C320-C323 = CAP: Capacitor; Value: 100pF; Published: 8-Jun-2000; Revision: July-2002: Re-released for DXP Platform.; Publisher: Altium Limited
C327 C330 = 10nf: nameAlias: Value(F); Contributor: LCEDA_Lib; spicePre: C; spiceSymbolName: C_0201_US
C328 C331 = 10uf: nameAlias: Value(F); Contributor: LCEDA_Lib; spicePre: C; spiceSymbolName: C_0201_US
FB16 = Inductor: BLM18KG121TN1D; Code_IEC: 1005; Value: 10mH; Published: 8-Jun-2000; LatestRevisionDate: 29-May-2009; LatestRevisionNote: IPC-7351 Footprint Added.; PackageReference: 0402-A; Publisher: Altium Limited; PackageDescription: Chip Inductor; Code_JEITA: 0402
LED36-LED45 = LED
LED58-LED61 LED62#1 = LED-0603: Manufacturer: EVERLIGHT(台湾亿光); Manufacturer Part: 19-217/R6C-AL1M2VY/3T; Contributor: LCEDA_01; Supplier Part: C72044; Supplier: LCSC; spicePre: L; spiceSymbolName: LED-0603_R
R390 R391 R428 R451 R485 = 470R: nameAlias: Value(Ω); Contributor: LCEDA_Lib; spicePre: R; spiceSymbolName: R_0603_EU
R392-R427 R429-R434 R438-R449 R452 R455 R461 R462 R464 R465 R472 R473 R475-R477 R479 R481 R483 R486-R503 = RES_Dup2: AC0402FR-070RL/YAGEO; Part Reference: R97; CLASS: DISCRETE; SIGNAL_MODEL: DEFAULT_RESISTOR_33.000000OHM_2_1; FPLIST: RC0603_OV; CAD_APPROVED: Yes; MFG_PN01: CR-02FL6---33R; MFG_NAME01: YAGEO; Tolerance: 1%; AGILE_PN: 470-75790; TOL: 5%; ROHS: Yes; HEIGHT: 0.4MM; PCB Footprint: R0402
R435 R436 = R_Dup3: Part Reference: R130; PCB Footprint: R0402
R437 = R_Dup3: Part Reference: R131; PCB Footprint: R0402
R450 = 2.49K: nameAlias: Value(Ω); Contributor: LCEDA_Lib; spicePre: R; spiceSymbolName: R_0603_EU
R453 R454 R456-R460 R463 R466-R471 R474 R514 = 4.7K: nameAlias: Value(Ω); Contributor: LCEDA_Lib; spicePre: R; spiceSymbolName: R_0603_EU
R504 R506 R507 R510 R511 = 1.5K: nameAlias: Value(Ω); Contributor: LCEDA_Lib; spicePre: R; spiceSymbolName: R_0603_EU
R512 R513 = 0R: nameAlias: Value(Ω); Contributor: LCEDA_Lib; spicePre: R; spiceSymbolName: R_0603_EU
U11 = RTL8367RB-VB-CG: Contributor: libc0607; link: https://www.realtek.com/en/products/communications-network-ics/item/rtl8367rb-vb-cg; spicePre: U; spiceSymbolName: RTL8367RB-VB-CG

## Sheet 15-PWR_1.SchDoc: KARGOBOT-TBOX-V2.0
size 513 x 386 mm; Page Create Date: March  8, 1995; Page Number: 4; Page Size: C; Page Count: 81; RevCode: A; DsnPath: C:\Users\Administrator\Desktop\123\KARGOBOT-TCU-ORIN-V1.1.DSN; SchematicName: KARGOBT-TCU-ORIN-V1.1; PageName: N100; PageSize: C; TopSchematic: True
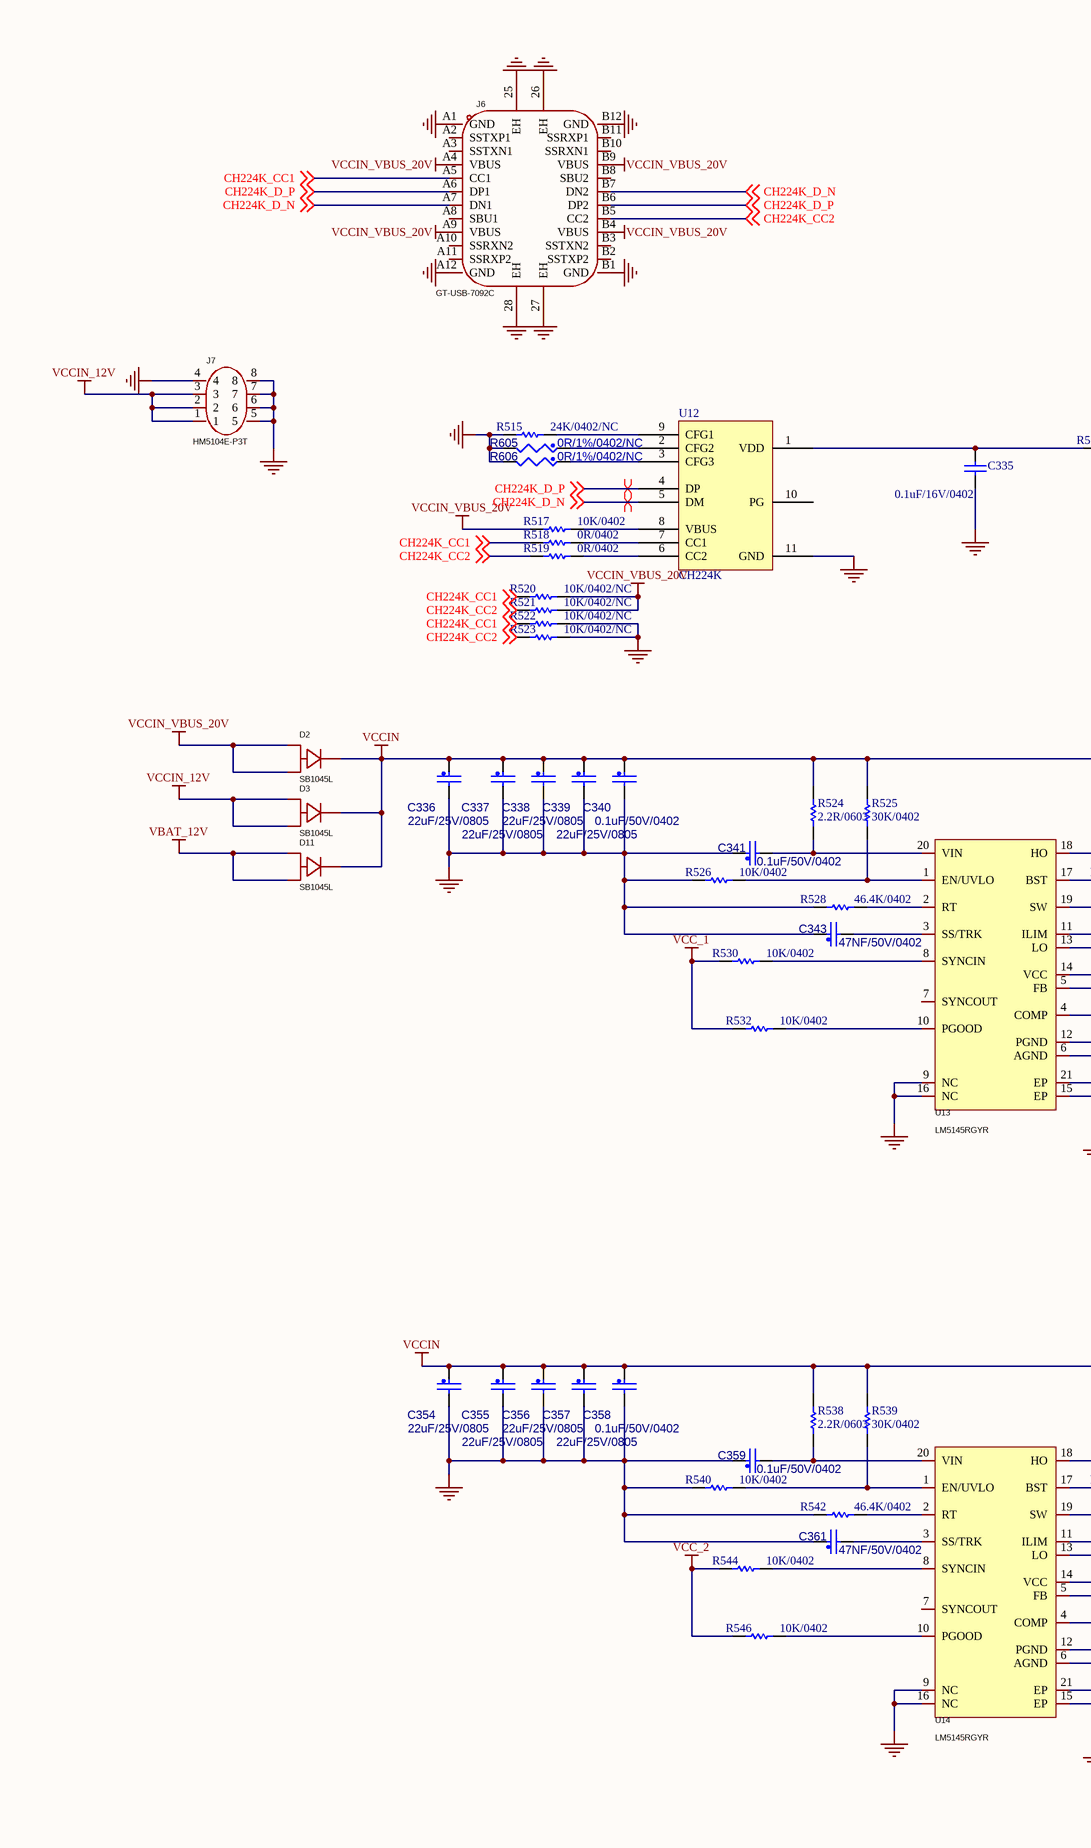
[diagram p24: 15-PWR_1.SchDoc, left]
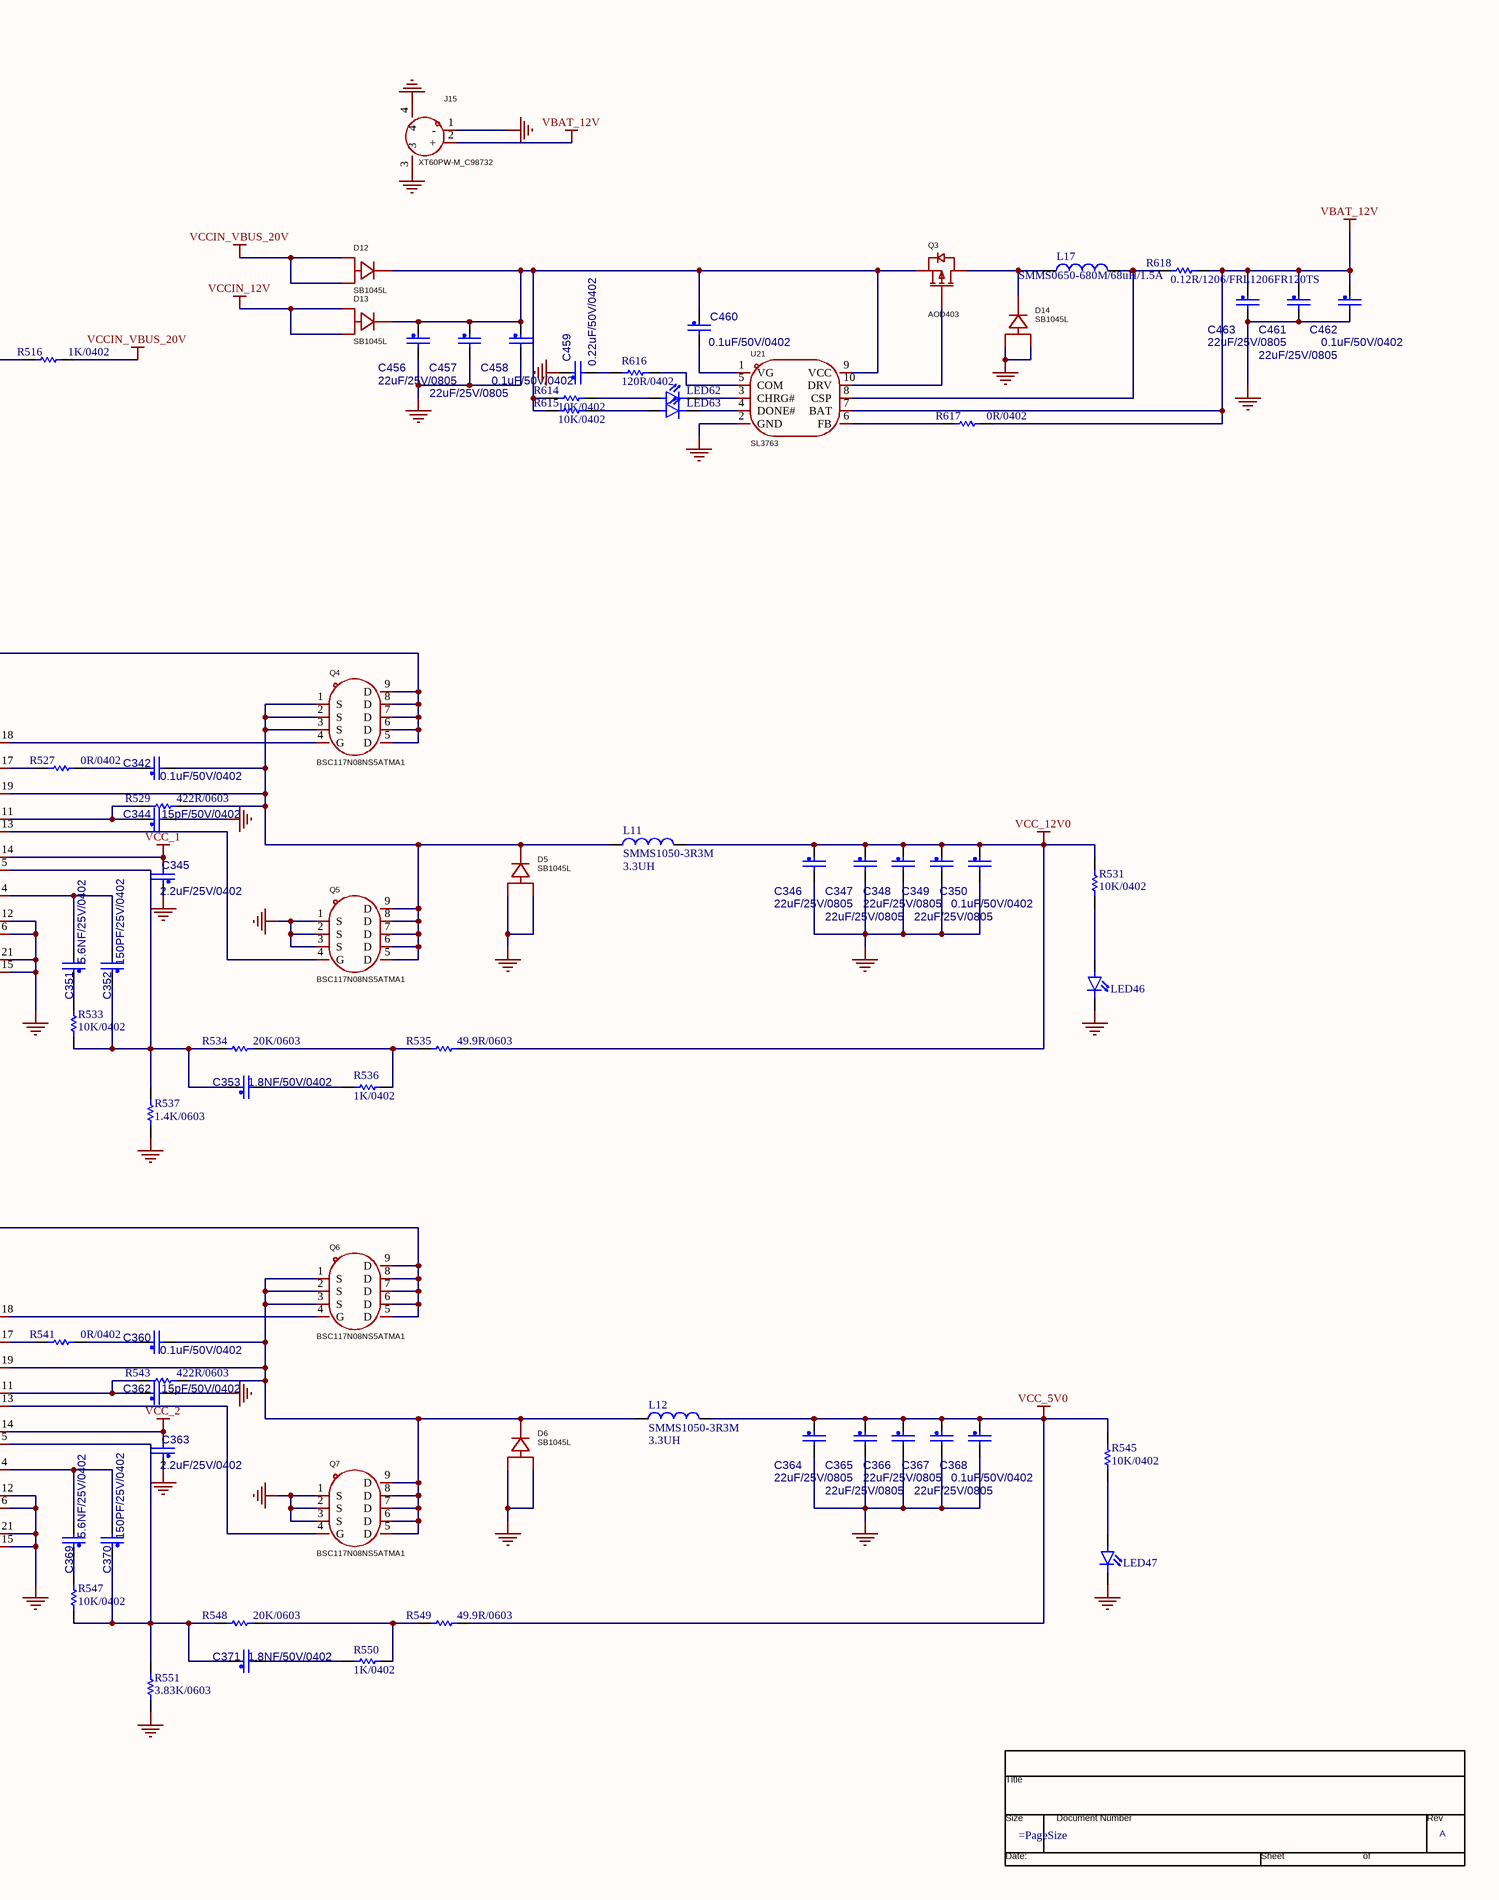
[diagram p25: 15-PWR_1.SchDoc, right]

### Parts
(Parts that share a designator on the sheet are numbered #1, #2 ... from top to bottom, then left to right.)
*#10  RevCode: A  (graphical)
C335  0.1uF/16V/0402  [C0402]
C336  value 22uF/25V/0805  [C0805]  (hidden comment: CAP_NP)
C337  value 22uF/25V/0805  [C0805]  (hidden comment: CAP_NP)
C338  value 22uF/25V/0805  [C0805]  (hidden comment: CAP_NP)
C339  value 22uF/25V/0805  [C0805]  (hidden comment: CAP_NP)
C340  value 0.1uF/50V/0402  [C0402]  (hidden comment: CAP_NP)
C341  value 0.1uF/50V/0402  [C0402]  (hidden comment: CAP_NP)
C342  value 0.1uF/50V/0402  [C0402]  (hidden comment: CAP_NP)
C343  value 47NF/50V/0402  [C0402]  (hidden comment: CAP_NP)
C344  value 15pF/50V/0402  [C0402]  (hidden comment: CAP_NP)
C345  value 2.2uF/25V/0402  [C0402]  (hidden comment: CAP_NP)
C346  value 22uF/25V/0805  [C0805]  (hidden comment: CAP_NP)
C347  value 22uF/25V/0805  [C0805]  (hidden comment: CAP_NP)
C348  value 22uF/25V/0805  [C0805]  (hidden comment: CAP_NP)
C349  value 22uF/25V/0805  [C0805]  (hidden comment: CAP_NP)
C350  value 0.1uF/50V/0402  [C0402]  (hidden comment: CAP_NP)
C351  value 5.6NF/25V/0402  [C0402]  (hidden comment: CAP_NP)
C352  value 150PF/25V/0402  [C0402]  (hidden comment: CAP_NP)
C353  value 1.8NF/50V/0402  [C0402]  (hidden comment: CAP_NP)
C354  value 22uF/25V/0805  [C0805]  (hidden comment: CAP_NP)
C355  value 22uF/25V/0805  [C0805]  (hidden comment: CAP_NP)
C356  value 22uF/25V/0805  [C0805]  (hidden comment: CAP_NP)
C357  value 22uF/25V/0805  [C0805]  (hidden comment: CAP_NP)
C358  value 0.1uF/50V/0402  [C0402]  (hidden comment: CAP_NP)
C359  value 0.1uF/50V/0402  [C0402]  (hidden comment: CAP_NP)
C360  value 0.1uF/50V/0402  [C0402]  (hidden comment: CAP_NP)
C361  value 47NF/50V/0402  [C0402]  (hidden comment: CAP_NP)
C362  value 15pF/50V/0402  [C0402]  (hidden comment: CAP_NP)
C363  value 2.2uF/25V/0402  [C0402]  (hidden comment: CAP_NP)
C364  value 22uF/25V/0805  [C0805]  (hidden comment: CAP_NP)
C365  value 22uF/25V/0805  [C0805]  (hidden comment: CAP_NP)
C366  value 22uF/25V/0805  [C0805]  (hidden comment: CAP_NP)
C367  value 22uF/25V/0805  [C0805]  (hidden comment: CAP_NP)
C368  value 0.1uF/50V/0402  [C0402]  (hidden comment: CAP_NP)
C369  value 5.6NF/25V/0402  [C0402]  (hidden comment: CAP_NP)
C370  value 150PF/25V/0402  [C0402]  (hidden comment: CAP_NP)
C371  value 1.8NF/50V/0402  [C0402]  (hidden comment: CAP_NP)
C456  value 22uF/25V/0805  [C0805]  (hidden comment: CAP_NP)
C457  value 22uF/25V/0805  [C0805]  (hidden comment: CAP_NP)
C458  value 0.1uF/50V/0402  [C0402]  (hidden comment: CAP_NP)
C459  value 0.22uF/50V/0402  [C0402]  (hidden comment: CAP_NP)
C460  value 0.1uF/50V/0402  [C0402]  (hidden comment: CAP_NP)
C461  value 22uF/25V/0805  [C0805]  (hidden comment: CAP_NP)
C462  value 0.1uF/50V/0402  [C0402]  (hidden comment: CAP_NP)
C463  value 22uF/25V/0805  [C0805]  (hidden comment: CAP_NP)
D2  SB1045L  [TO-277_3P-L5.4-W4.0-LS6.5-TR]
D3  SB1045L  [TO-277_3P-L5.4-W4.0-LS6.5-TR]
D5  SB1045L  [TO-277_3P-L5.4-W4.0-LS6.5-TR]
D6  SB1045L  [TO-277_3P-L5.4-W4.0-LS6.5-TR]
D11  SB1045L  [TO-277_3P-L5.4-W4.0-LS6.5-TR]
D12  SB1045L  [TO-277_3P-L5.4-W4.0-LS6.5-TR]
D13  SB1045L  [TO-277_3P-L5.4-W4.0-LS6.5-TR]
D14  SB1045L  [TO-277_3P-L5.4-W4.0-LS6.5-TR]
J6  GT-USB-7092C  [USB-C-SMD_GT-USB-7092C]
J7  HM5104E-P3T  [HM5104E-P3T]
J15  XT60PW-M_C98732  [CONN-TH_XT60PW-M]
L11  SMMS1050-3R3M  value 3.3UH  [SMMS1050-3R3M]
L12  SMMS1050-3R3M  value 3.3UH  [SMMS1050-3R3M]
L17  SMMS0650-680M/68uH/1.5A  [SMMS0650-680M]
LED46  LED_GREEN  [LED0603]  (value not drawn)
LED47  LED_GREEN  [LED0603]  (value not drawn)
LED62#2  LED_GREEN  [LED0603]  (value not drawn)
LED63  LED_GREEN  [LED0603]  (value not drawn)
Q3  AOD403  [TO-252-3_L6.6-W6.1-P4.58-LS10.1-BR-2]
Q4  BSC117N08NS5ATMA1  [DFN-8_L5.9-W5.2-P1.27-LS6.2-BL]
Q5  BSC117N08NS5ATMA1  [DFN-8_L5.9-W5.2-P1.27-LS6.2-BL]
Q6  BSC117N08NS5ATMA1  [DFN-8_L5.9-W5.2-P1.27-LS6.2-BL]
Q7  BSC117N08NS5ATMA1  [DFN-8_L5.9-W5.2-P1.27-LS6.2-BL]
R515  24K/0402/NC  [R0402]
R516  1K/0402  [R0402]
R517  10K/0402  [R0402]
R518  0R/0402  [R0402]
R519  0R/0402  [R0402]
R520  10K/0402/NC  [R0402]
R521  10K/0402/NC  [R0402]
R522  10K/0402/NC  [R0402]
R523  10K/0402/NC  [R0402]
R524  2.2R/0603  [R0603]
R525  30K/0402  [R0402]
R526  10K/0402  [R0402]
R527  0R/0402  [R0402]
R528  46.4K/0402  [R0402]
R529  422R/0603  [R0603]
R530  10K/0402  [R0402]
R531  10K/0402  [R0402]
R532  10K/0402  [R0402]
R533  10K/0402  [R0402]
R534  20K/0603  [R0603]
R535  49.9R/0603  [R0603]
R536  1K/0402  [R0402]
R537  1.4K/0603  [R0603]
R538  2.2R/0603  [R0603]
R539  30K/0402  [R0402]
R540  10K/0402  [R0402]
R541  0R/0402  [R0402]
R542  46.4K/0402  [R0402]
R543  422R/0603  [R0603]
R544  10K/0402  [R0402]
R545  10K/0402  [R0402]
R546  10K/0402  [R0402]
R547  10K/0402  [R0402]
R548  20K/0603  [R0603]
R549  49.9R/0603  [R0603]
R550  1K/0402  [R0402]
R551  3.83K/0603  [R0603]
R605  value 0R/1%/0402/NC  [R0402]  (hidden comment: RES_Dup2)
R606  value 0R/1%/0402/NC  [R0402]  (hidden comment: RES_Dup2)
R614  10K/0402  [R0402]
R615  10K/0402  [R0402]
R616  120R/0402  [R0402]
R617  0R/0402  [R0402]
R618  0.12R/1206/FRL1206FR120TS  [R1206]
U12  CH224K  [CH224K_ ESSOP-10]
U13  LM5145RGYR  [VQFN-20_L4.5-W3.5-P0.50-BL-EP]
U14  LM5145RGYR  [VQFN-20_L4.5-W3.5-P0.50-BL-EP]
U21  SL3763  [SSOP-10_L4.9-W3.9-P1.00-LS6.0-BL-1]

### Nets
GND: C335.1 C336.2 C337.2 C338.2 C339.2 C340.2 C341.1 C343.1 C344.2 C345.1 C346.2 C347.2 C348.2 C349.2 C350.2 C354.2 C355.2 C356.2 C357.2 C358.2 C359.1 C361.1 C362.2 C363.1 C364.2 C365.2 C366.2 C367.2 C368.2 C456.2 C457.2 C458.2 C459.1 C461.2 C462.2 C463.2 D5.1(A) D5.3(A) D6.1(A) D6.3(A) D14.1(A) D14.3(A) J6.25(EH) J6.26(EH) J6.27(EH) J6.28(EH) J6.A1(GND) J6.A12(GND) J6.B1(GND) J6.B12(GND) J7.4 J7.5 J7.6 J7.7 J7.8 J15.1(-) J15.3 J15.4 LED46.2 LED47.2 Q5.1(S) Q5.2(S) Q5.3(S) Q7.1(S) Q7.2(S) Q7.3(S) R515.1 R522.2 R523.2 R526.1 R528.2 R537.2 R540.1 R542.2 R551.2 R605.2 R606.2 U12.11(GND) U13.6(AGND) U13.9(NC) U13.12(PGND) U13.15(EP) U13.16(NC) U13.21(EP) U14.6(AGND) U14.9(NC) U14.12(PGND) U14.15(EP) U14.16(NC) U14.21(EP) U21.2(GND)
VBAT_12V: C461.1 C462.1 C463.1 D11.1(A) D11.3(A) J15.2(+) R617.2 R618.2 U21.7(BAT)
VCC_1: C345.2 R530.1 R532.1 U13.14(VCC)
VCC_2: C363.2 R544.1 R546.1 U14.14(VCC)
VCC_5V0: C364.1 C365.1 C366.1 C367.1 C368.1 L12.2 R545.1 R549.1
VCC_12V0: C346.1 C347.1 C348.1 C349.1 C350.1 L11.2 R531.1 R535.1
VCCIN: C336.1 C337.1 C338.1 C339.1 C340.1 C354.1 C355.1 C356.1 C357.1 C358.1 D2.2(K) D3.2(K) D11.2(K) Q4.5(D) Q4.6(D) Q4.7(D) Q4.8(D) Q4.9(D) Q6.5(D) Q6.6(D) Q6.7(D) Q6.8(D) Q6.9(D) R524.2 R525.2 R538.2 R539.2
VCCIN_12V: D3.1(A) D3.3(A) D13.1(A) D13.3(A) J7.1 J7.2 J7.3
VCCIN_VBUS_20V: D2.1(A) D2.3(A) D12.1(A) D12.3(A) J6.A4(VBUS) J6.A9(VBUS) J6.B4(VBUS) J6.B9(VBUS) R516.2 R517.1 R520.2 R521.2
CH224K_CC1: J6.A5(CC1) R518.1 R520.1 R522.1 ; off-sheet CH224K_CC1
CH224K_CC2: J6.B5(CC2) R519.1 R521.1 R523.1 ; off-sheet CH224K_CC2
CH224K_D_N: J6.A7(DN1) J6.B7(DN2) U12.5(DM) ; off-sheet CH224K_D_N
CH224K_D_P: J6.A6(DP1) J6.B6(DP2) U12.4(DP) ; off-sheet CH224K_D_P
NetC335_2: C335.2 R516.1 U12.1(VDD)
NetC341_2: C341.2 R524.1 U13.20(VIN)
NetC342_1: C342.1 R527.2
NetC342_2: C342.2 D5.2(K) L11.1 Q4.1(S) Q4.2(S) Q4.3(S) Q5.5(D) Q5.6(D) Q5.7(D) Q5.8(D) Q5.9(D) R529.1 U13.19(SW)
NetC343_2: C343.2 U13.3(SS/TRK)
NetC344_1: C344.1 R529.2 U13.11(ILIM)
NetC351_1: C351.1 R533.2
NetC351_2: C351.2 C352.2 U13.4(COMP)
NetC352_1: C352.1 C353.1 R533.1 R534.2 R537.1 U13.5(FB)
NetC353_2: C353.2 R536.2
NetC359_2: C359.2 R538.1 U14.20(VIN)
NetC360_1: C360.1 R541.2
NetC360_2: C360.2 D6.2(K) L12.1 Q6.1(S) Q6.2(S) Q6.3(S) Q7.5(D) Q7.6(D) Q7.7(D) Q7.8(D) Q7.9(D) R543.1 U14.19(SW)
NetC361_2: C361.2 U14.3(SS/TRK)
NetC362_1: C362.1 R543.2 U14.11(ILIM)
NetC369_1: C369.1 R547.2
NetC369_2: C369.2 C370.2 U14.4(COMP)
NetC370_1: C370.1 C371.1 R547.1 R548.2 R551.1 U14.5(FB)
NetC371_2: C371.2 R550.2
NetC456_1: C456.1 C457.1 C458.1 C460.1 D12.2(K) D13.2(K) Q3.3(S) R614.1 R615.1 U21.9(VCC)
NetC459_2: C459.2 R616.1
NetC460_2: C460.2 U21.1(VG)
NetD14_2: D14.2(K) L17.1 Q3.2(D)
NetL17_2: L17.2 R618.1 U21.8(CSP)
NetLED46_1: LED46.1 R531.2
NetLED47_1: LED47.1 R545.2
NetLED62#2_1: LED62#2.1 R614.2
NetLED62#2_2: LED62#2.2 U21.3(CHRG#)
NetLED63_1: LED63.1 R615.2
NetLED63_2: LED63.2 U21.4(DONE#)
NetQ3_1: Q3.1(G) U21.10(DRV)
NetQ4_4: Q4.4(G) U13.18(HO)
NetQ5_4: Q5.4(G) U13.13(LO)
NetQ6_4: Q6.4(G) U14.18(HO)
NetQ7_4: Q7.4(G) U14.13(LO)
NetR515_2: R515.2 U12.9(CFG1)
NetR517_2: R517.2 U12.8(VBUS)
NetR518_2: R518.2 U12.7(CC1)
NetR519_2: R519.2 U12.6(CC2)
NetR525_1: R525.1 R526.2 U13.1(EN/UVLO)
NetR527_1: R527.1 U13.17(BST)
NetR528_1: R528.1 U13.2(RT)
NetR530_2: R530.2 U13.8(SYNCIN)
NetR532_2: R532.2 U13.10(PGOOD)
NetR534_1: R534.1 R535.2 R536.1
NetR539_1: R539.1 R540.2 U14.1(EN/UVLO)
NetR541_1: R541.1 U14.17(BST)
NetR542_1: R542.1 U14.2(RT)
NetR544_2: R544.2 U14.8(SYNCIN)
NetR546_2: R546.2 U14.10(PGOOD)
NetR548_1: R548.1 R549.2 R550.1
NetR605_1: R605.1 U12.2(CFG2)
NetR606_1: R606.1 U12.3(CFG3)
NetR616_2: R616.2 U21.5(COM)
NetR617_1: R617.1 U21.6(FB)

Not connected (* = marked no-connect by the designer): J6 A2(SSTXP1) A3(SSTXN1) A8(SBU1) A10(SSRXN2) A11(SSRXP2) B2(SSTXP2) B3(SSTXN2) B8(SBU2) B10(SSRXN1) B11(SSRXP1); U12 10(PG); U13 7(SYNCOUT); U14 7(SYNCOUT)

### Layout directives
differential pair: CH224K_D_N, CH224K_D_P

### Notes on the sheet
- (in symbol TitleBlock0) Title; Size; Document Number; Rev; Date:; Sheet; of

### Library data of the parts
*#10 = TitleBlock0: Page Count: 81; Page Number: 4; Title: KARGOBOT-TBOX-V2.0; Page Size: =PageSize; Page Create Date: March  8, 1995; Page Modify Date: =ModifiedDate
C335 = CAP: Capacitor; Value: 100pF; Published: 8-Jun-2000; Revision: July-2002: Re-released for DXP Platform.; Publisher: Altium Limited
C336-C339 C346-C349 C354-C357 C364-C367 C456 C457 C461 C463 = CAP_NP: GRT31CC71E226ME13/MURATA; Part Reference: C13; CLASS: DISCRETE; VOLTAGE: 10v; CAD_APPROVED: Yes; MFG_PN01: C1608X5R1A106K; MFG_NAME01: TDK; TOL: 10%; AGILE_PN: 150-78675; FPLIST: CC0603_OV,CC0603,0603_CC; PCB Footprint: C1206; HEIGHT: 1.016MM; ROHS: Yes; Tolerance: 10%
C340-C345 C350-C353 C358-C363 C368-C371 C458-C460 C462 = CAP_NP: as C216-C225 on sheet 14-RTL8367; HEIGHT: 0.635MM; ROHS: Yes; TOL: 10%; PCB Footprint: C0402
D2 D3 D5 D6 D11-D14 = SB1045L_C908747: Manufacturer: GOODWORK(固得沃克); Add into BOM: yes; Diode Configuration: 独立式; Forward Voltage (Vf@If): 530mV@10A; Reverse Voltage (Vr): 45V; Average Rectified Current (Io): 10A; Reverse Leakage Current (Ir): 150uA@45V; Symbol: SB1045L_C908747; Device: SB1045L_C908747; LCSC Part Name: 电压:45V 电流:10A; Supplier Part: C908747; Manufacturer Part: SB1045L; Supplier Footprint: TO-277; JLCPCB Part Class: Extended Part; Datasheet: https://atta.szlcsc.com/upload/public/pdf/source/20210105/C908747_DE348528BC53D9CC51537B568EB9903F.pdf; Supplier: LCSC; Convert to PCB: yes; Comment_1: SB1045L
J6 = GT-USB-7092C: Manufacturer: G-Switch(品赞); Add into BOM: yes; Connector Type: Type-C; Gender: 母; Number of Contacts: 24P; Number of Ports: 1; Current Rating - Power (Max): 5A; Rated Voltage (Max): 24V; Connect-Disconnect Life: 1万次; Center Height: 7.2mm; Core Colour: 黑色; Symbol: GT-USB-7092C; Device: GT-USB-7092C; LCSC Part Name: Type-C 母 侧贴; Supplier Part: C22471968; Manufacturer Part: GT-USB-7092C; Supplier Footprint: SMD; JLCPCB Part Class: Extended Part; Datasheet: https://atta.szlcsc.com/upload/public/pdf/source/20240624/0752ADA6134B10077FCDD9A2DA872EFC.pdf; Supplier: LCSC; Convert to PCB: yes; Standard: USB 3.1; Mounting Style: 侧贴; Length: 13.9mm; Operating Temperature Range: -40℃~+85℃; Comment_1: GT-USB-7092C
J7 = 1726750814: Manufacturer: MOLEX; Add into BOM: yes; Row Spacing: 4.2mm; Symbol: 1726750814; Device: 1726750814; LCSC Part Name: 1726750814; Supplier Part: C17608453; Manufacturer Part: 1726750814; Supplier Footprint: 插件; JLCPCB Part Class: Extended Part; Datasheet: https://www.molex.com/content/dam/molex/molex-dot-com/products/automated/en-us/salesdrawingpdf/172/172675/1726750814_sd.pdf?inline; Supplier: LCSC; Convert to PCB: yes; Mounting Style: 直插; Number of Rows: 2; Contact Material: 铜合金; Contact Plating: 锡; Comment_1: 1726750814
J15 = XT60PW-M: Manufacturer: AMASS(艾迈斯); Add into BOM: yes; Brand: 艾迈斯; InterfaceType: 公头; Symbol: XT60PW-M; Device: XT60PW-M; LCSC Part Name: AMASS(艾迈斯)航模插头xt60连接器150公母对接pw锂电池公头 板插卧式XT60PW-M; Supplier Part: C98732; Manufacturer Part: XT60PW-M; Supplier Footprint: -; JLCPCB Part Class: Extended Part; Datasheet: https://atta.szlcsc.com/upload/public/pdf/source/20240118/44A3DCFF53BE25DC65378AFFB21277A4.pdf; Supplier: LCSC; Convert to PCB: yes; Model: XT60PW-M; Power: -; Output: -; Input: -; Size: -; Interface: -; Type: 卧式插头; Colour: 黄色; MaximumCurrent: -; RatedVoltage: -; Type1: -; NumberOfUSBHoles: -; MetalMaterial: -; InsulationMaterial: -; RatedCurrent: -; RecommendedWireGauge: -; FlameRetardantGrade: -; contact resistance: -; Belt length: -; specifications: -
L11 L12 = Inductor: Code_IEC: 1005; Published: 8-Jun-2000; LatestRevisionDate: 29-May-2009; LatestRevisionNote: IPC-7351 Footprint Added.; PackageReference: 0402-A; Publisher: Altium Limited; PackageDescription: Chip Inductor; Code_JEITA: 0402
L17 = Inductor: FXC0630-5R6M; Code_IEC: 1005; Value: 2.2uH; Published: 8-Jun-2000; LatestRevisionDate: 29-May-2009; LatestRevisionNote: IPC-7351 Footprint Added.; PackageReference: 0402-A; Publisher: Altium Limited; PackageDescription: Chip Inductor; Code_JEITA: 0402
LED46 LED47 LED62#2 LED63 = LED
Q3 = AOD403_C5224305: Manufacturer: ElecSuper(静芯微); Add into BOM: yes; Type: 1个P沟道; Drain Source Voltage (Vdss): 30V; Continuous Drain Current (Id): 62A; Drain Source On Resistance (RDS(on)@Vgs,Id): 8mΩ@10V; Power Dissipation (Pd): 79W; Gate Threshold Voltage (Vgs(th)@Id): 2V@20A; Total Gate Charge (Qg@Vgs): 61nC; Input Capacitance (Ciss@Vds): 3.5nF@0V; Reverse Transfer Capacitance (Crss@Vds): 660pF@15V; Symbol: AOD403_C5224305; Device: AOD403_C5224305; LCSC Part Name: P沟道,电流:62A,耐压:30V; Supplier Part: C5224305; Manufacturer Part: AOD403; Supplier Footprint: TO-252; JLCPCB Part Class: Extended Part; Datasheet: https://atta.szlcsc.com/upload/public/pdf/source/20240905/94D7CD2F64083621076EDE6D140A89A0.pdf; Supplier: LCSC; Convert to PCB: yes; Operating Temperature: -55℃~+150℃; Comment_1: AOD403
Q4-Q7 = BSC117N08NS5ATMA1-VB: Manufacturer: VBsemi(微碧半导体); Add into BOM: yes; Symbol: BSC117N08NS5ATMA1-VB; Device: BSC117N08NS5ATMA1-VB; LCSC Part Name: BSC117N08NS5ATMA1-VB; Supplier Part: C22395965; Manufacturer Part: BSC117N08NS5ATMA1-VB; Supplier Footprint: DFN-8(5x6); JLCPCB Part Class: Extended Part; Datasheet: https://atta.szlcsc.com/upload/public/pdf/source/20240509/FBEE2FAA355846CAD7B0AB561ACDED61.pdf; Supplier: LCSC; Convert to PCB: yes; Comment_1: BSC117N08NS5ATMA1-VB
R515-R530 R532-R544 R546-R551 R617 = Res Semi: Semiconductor Resistor; Value: 240R; Published: 8-Jun-2000; LatestRevisionDate: 17-Jul-2002; LatestRevisionNote: Re-released for DXP Platform.; PackageReference: AXIAL-0.5; Publisher: Altium Limited; PackageDescription: Axial Device, Thru-Hole; 2 Leads; 0.5 in Pin Spacing
R531 R545 R614-R616 R618 = Res Semi: Semiconductor Resistor; Value: 1K; Published: 8-Jun-2000; LatestRevisionDate: 17-Jul-2002; LatestRevisionNote: Re-released for DXP Platform.; PackageReference: AXIAL-0.5; Publisher: Altium Limited; PackageDescription: Axial Device, Thru-Hole; 2 Leads; 0.5 in Pin Spacing
R605 R606 = RES_Dup2: as R392-R427 on sheet 14-RTL8367; ROHS: Yes; HEIGHT: 0.4MM; PCB Footprint: R0402
U13 U14 = LM5145RGYR: Manufacturer: TI(德州仪器); Add into BOM: yes; Function: 降压型; Input Voltage: 6V~75V; Switching Frequency: 1MHz; Synchronous Rectification: 是; Number of Outputs: 1; Topology: 降压式; Symbol: LM5145RGYR; Device: LM5145RGYR; LCSC Part Name: LM5145RGYR; Supplier Part: C485912; Manufacturer Part: LM5145RGYR; Supplier Footprint: VQFN-20-EP(3.5x4.5); JLCPCB Part Class: Extended Part; Datasheet: https://www.ti.com/cn/lit/gpn/lm5145; Supplier: LCSC; Convert to PCB: yes; Operating Temperature: -40℃~+125℃@(TJ); Comment_1: LM5145RGYR
U21 = SL3763: Manufacturer: Slkor(萨科微); Add into BOM: yes; The Chip Type: 充电芯片; Supply Voltage: 6.6V~30V; Maximum Charge Current: 4A; Number of Cells: 3; Symbol: SL3763; Device: SL3763; LCSC Part Name: SL3763; Supplier Part: C5122525; Manufacturer Part: SL3763; Supplier Footprint: SSOP-10; JLCPCB Part Class: Extended Part; Datasheet: https://atta.szlcsc.com/upload/public/pdf/source/20220805/EAFE5591DAA5C6B27C0EA0F854AFD0DF.pdf; Supplier: LCSC; Convert to PCB: yes; Operating Temperature: -40℃~+85℃; Comment_1: SL3763

## Sheet 16-PWR_2.SchDoc: KARGOBOT-TBOX-V2.0
size 513 x 386 mm; Page Create Date: March  8, 1995; Page Number: 4; Page Size: C; Page Count: 81; RevCode: A; DsnPath: C:\Users\Administrator\Desktop\123\KARGOBOT-TCU-ORIN-V1.1.DSN; SchematicName: KARGOBT-TCU-ORIN-V1.1; PageName: N100; PageSize: C; TopSchematic: True
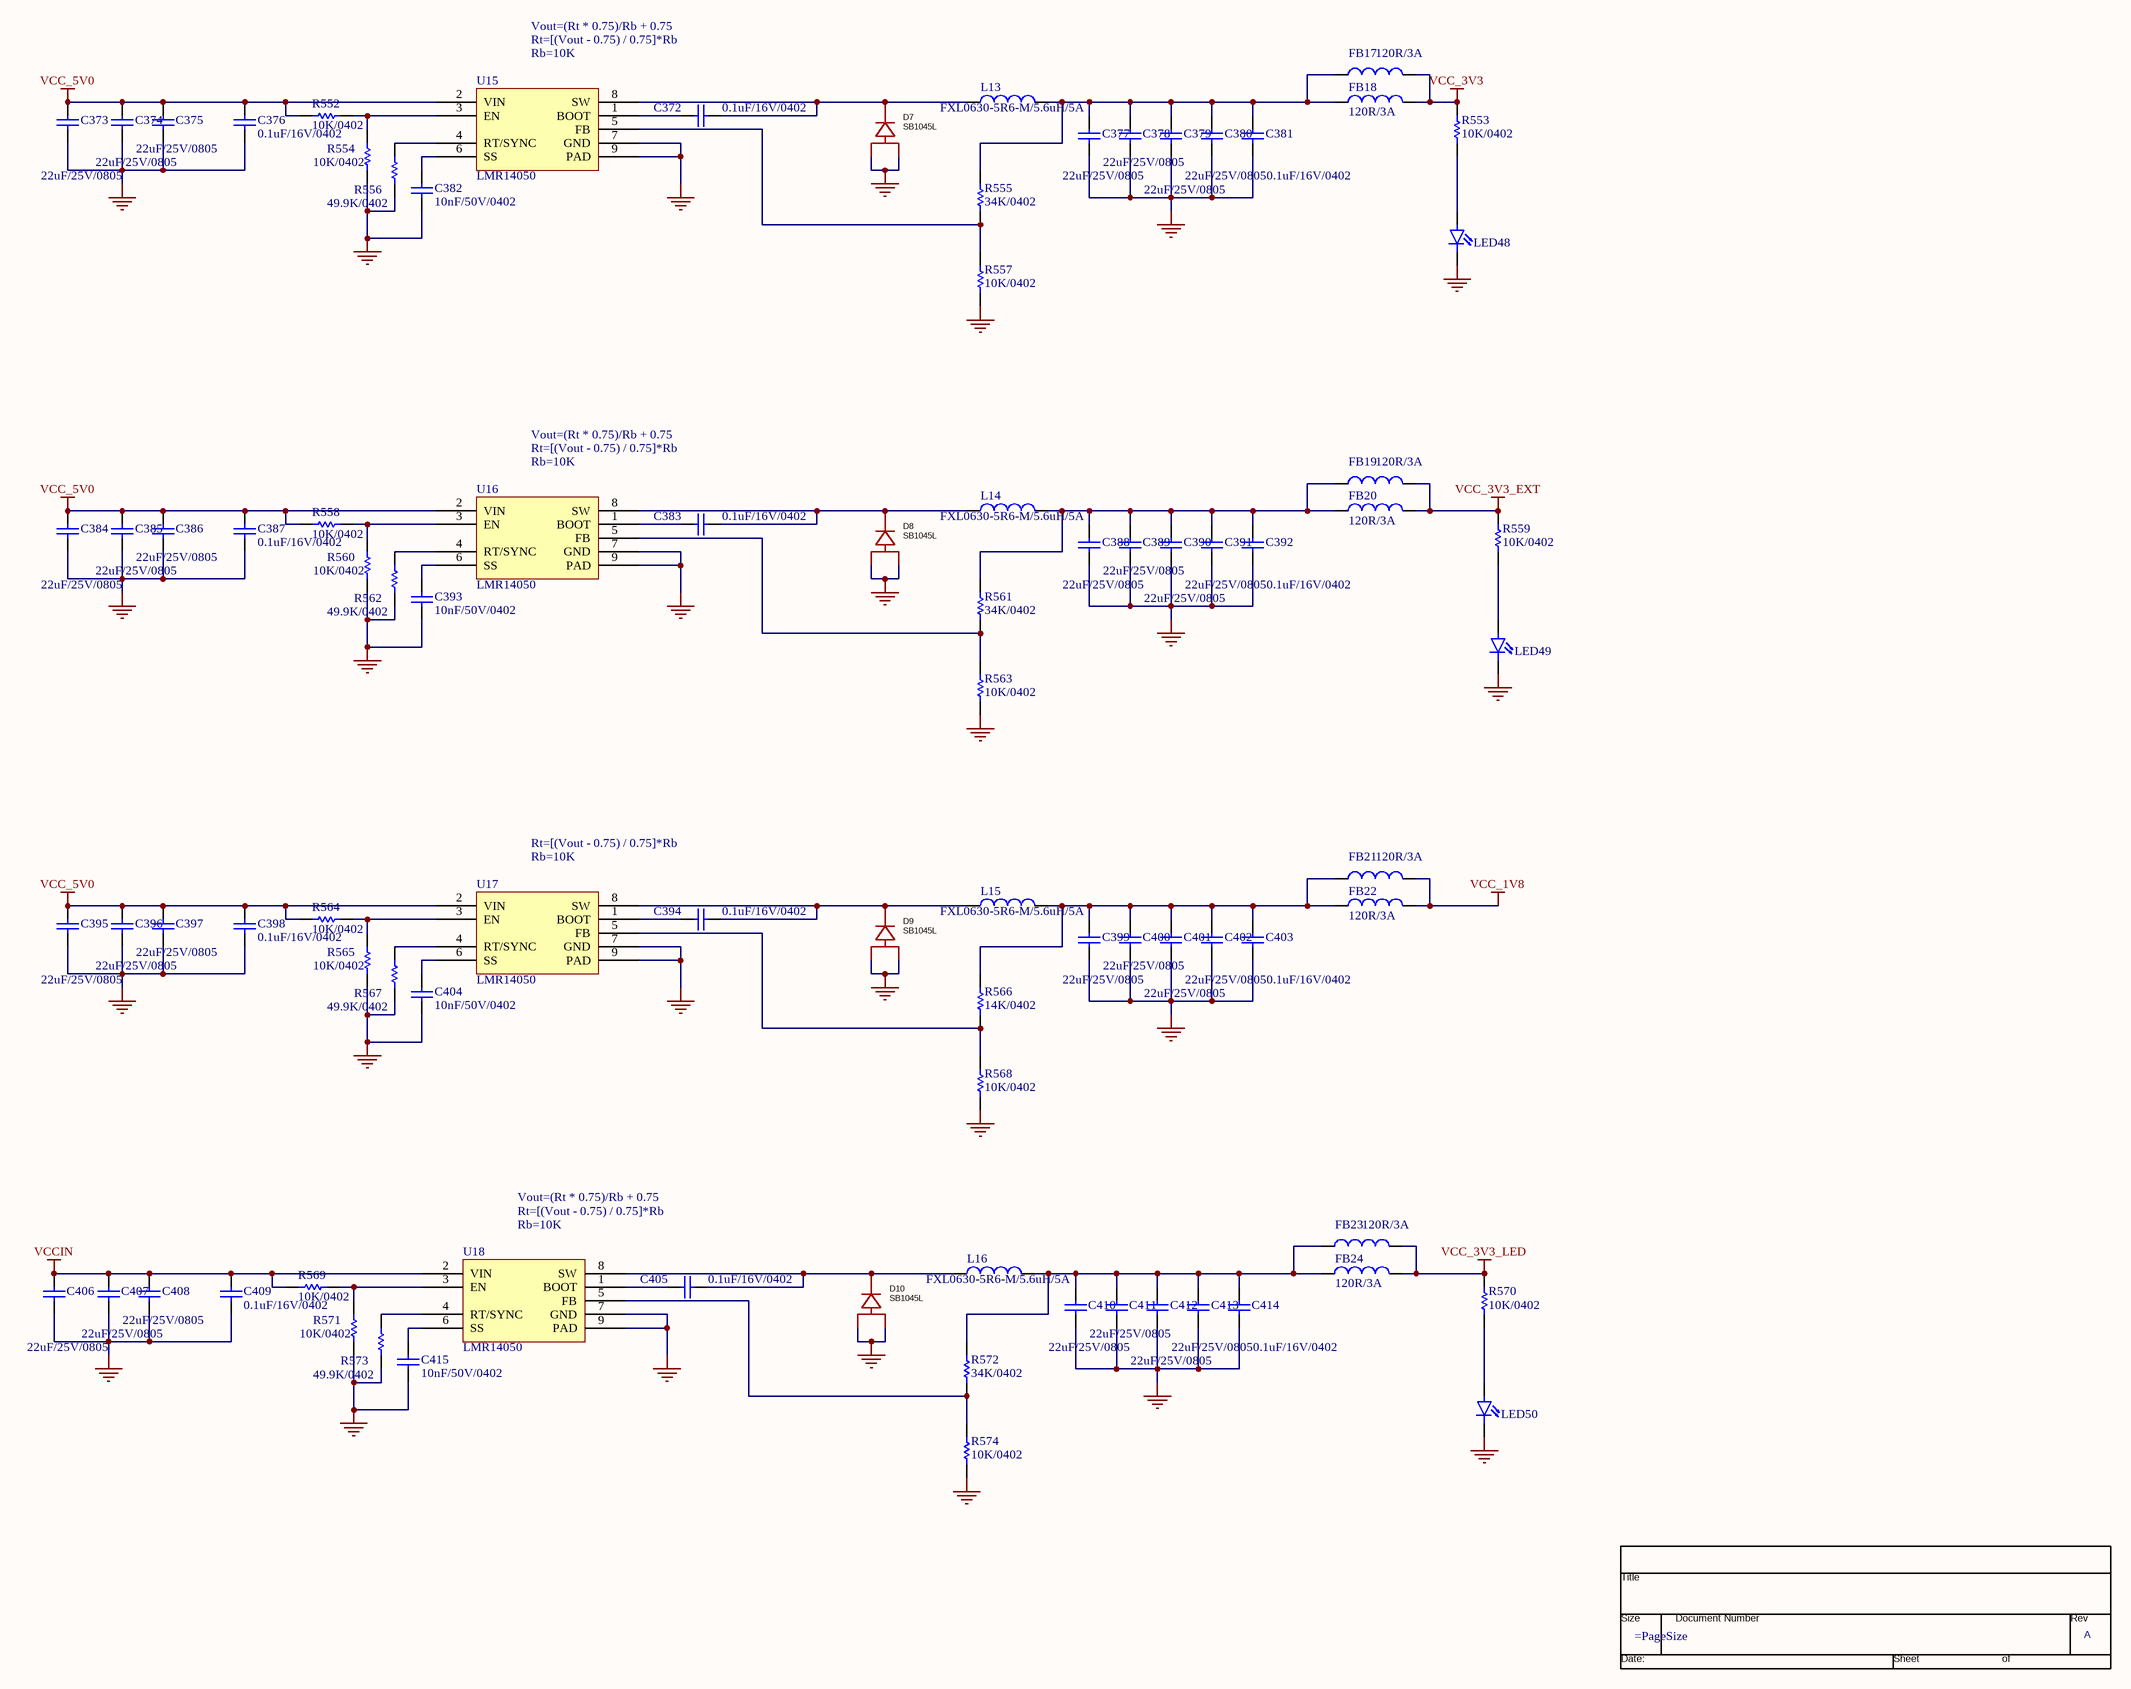
[diagram p26: 16-PWR_2.SchDoc]

### Parts
(Parts that share a designator on the sheet are numbered #1, #2 ... from top to bottom, then left to right.)
*#11  RevCode: A  (graphical)
C372  0.1uF/16V/0402  [C0402]
C373  22uF/25V/0805  [C0805]
C374  22uF/25V/0805  [C0805]
C375  22uF/25V/0805  [C0805]
C376  0.1uF/16V/0402  [C0402]
C377  22uF/25V/0805  [C0805]
C378  22uF/25V/0805  [C0805]
C379  22uF/25V/0805  [C0805]
C380  22uF/25V/0805  [C0805]
C381  0.1uF/16V/0402  [C0402]
C382  10nF/50V/0402  [C0402]
C383  0.1uF/16V/0402  [C0402]
C384  22uF/25V/0805  [C0805]
C385  22uF/25V/0805  [C0805]
C386  22uF/25V/0805  [C0805]
C387  0.1uF/16V/0402  [C0402]
C388  22uF/25V/0805  [C0805]
C389  22uF/25V/0805  [C0805]
C390  22uF/25V/0805  [C0805]
C391  22uF/25V/0805  [C0805]
C392  0.1uF/16V/0402  [C0402]
C393  10nF/50V/0402  [C0402]
C394  0.1uF/16V/0402  [C0402]
C395  22uF/25V/0805  [C0805]
C396  22uF/25V/0805  [C0805]
C397  22uF/25V/0805  [C0805]
C398  0.1uF/16V/0402  [C0402]
C399  22uF/25V/0805  [C0805]
C400  22uF/25V/0805  [C0805]
C401  22uF/25V/0805  [C0805]
C402  22uF/25V/0805  [C0805]
C403  0.1uF/16V/0402  [C0402]
C404  10nF/50V/0402  [C0402]
C405  0.1uF/16V/0402  [C0402]
C406  22uF/25V/0805  [C0805]
C407  22uF/25V/0805  [C0805]
C408  22uF/25V/0805  [C0805]
C409  0.1uF/16V/0402  [C0402]
C410  22uF/25V/0805  [C0805]
C411  22uF/25V/0805  [C0805]
C412  22uF/25V/0805  [C0805]
C413  22uF/25V/0805  [C0805]
C414  0.1uF/16V/0402  [C0402]
C415  10nF/50V/0402  [C0402]
D7  SB1045L  [TO-277_3P-L5.4-W4.0-LS6.5-TR]
D8  SB1045L  [TO-277_3P-L5.4-W4.0-LS6.5-TR]
D9  SB1045L  [TO-277_3P-L5.4-W4.0-LS6.5-TR]
D10  SB1045L  [TO-277_3P-L5.4-W4.0-LS6.5-TR]
FB17  120R/3A  [L0603]
FB18  120R/3A  [L0603]
FB19  120R/3A  [L0603]
FB20  120R/3A  [L0603]
FB21  120R/3A  [L0603]
FB22  120R/3A  [L0603]
FB23  120R/3A  [L0603]
FB24  120R/3A  [L0603]
L13  FXL0630-5R6-M/5.6uH/5A  [FXL0630-5R6-M]
L14  FXL0630-5R6-M/5.6uH/5A  [FXL0630-5R6-M]
L15  FXL0630-5R6-M/5.6uH/5A  [FXL0630-5R6-M]
L16  FXL0630-5R6-M/5.6uH/5A  [FXL0630-5R6-M]
LED48  LED_GREEN  [LED0603]  (value not drawn)
LED49  LED_GREEN  [LED0603]  (value not drawn)
LED50  LED_GREEN  [LED0603]  (value not drawn)
R552  10K/0402  [R0402]
R553  10K/0402  [R0402]
R554  10K/0402  [R0402]
R555  34K/0402  [R0402]
R556  49.9K/0402  [R0402]
R557  10K/0402  [R0402]
R558  10K/0402  [R0402]
R559  10K/0402  [R0402]
R560  10K/0402  [R0402]
R561  34K/0402  [R0402]
R562  49.9K/0402  [R0402]
R563  10K/0402  [R0402]
R564  10K/0402  [R0402]
R565  10K/0402  [R0402]
R566  14K/0402  [R0402]
R567  49.9K/0402  [R0402]
R568  10K/0402  [R0402]
R569  10K/0402  [R0402]
R570  10K/0402  [R0402]
R571  10K/0402  [R0402]
R572  34K/0402  [R0402]
R573  49.9K/0402  [R0402]
R574  10K/0402  [R0402]
U15  LMR14050  [LMR14030]
U16  LMR14050  [LMR14030]
U17  LMR14050  [LMR14030]
U18  LMR14050  [LMR14030]

### Nets
GND: C373.1 C374.1 C375.1 C376.1 C377.1 C378.1 C379.1 C380.1 C381.1 C382.1 C384.1 C385.1 C386.1 C387.1 C388.1 C389.1 C390.1 C391.1 C392.1 C393.1 C395.1 C396.1 C397.1 C398.1 C399.1 C400.1 C401.1 C402.1 C403.1 C404.1 C406.1 C407.1 C408.1 C409.1 C410.1 C411.1 C412.1 C413.1 C414.1 C415.1 D7.1(A) D7.3(A) D8.1(A) D8.3(A) D9.1(A) D9.3(A) D10.1(A) D10.3(A) LED48.2 LED49.2 LED50.2 R554.2 R556.2 R557.2 R560.2 R562.2 R563.2 R565.2 R567.2 R568.2 R571.2 R573.2 R574.2 U15.7(GND) U15.9(PAD) U16.7(GND) U16.9(PAD) U17.7(GND) U17.9(PAD) U18.7(GND) U18.9(PAD)
VCC_1V8: FB21.2 FB22.2  [project net 1V8_ORIN_F1]
VCC_3V3: FB17.2 FB18.2 R553.1  [project net 3V3_ORIN_F1]
VCC_3V3_EXT: FB19.2 FB20.2 R559.1
VCC_3V3_LED: FB23.2 FB24.2 R570.1
VCC_5V0: C373.2 C374.2 C375.2 C376.2 C384.2 C385.2 C386.2 C387.2 C395.2 C396.2 C397.2 C398.2 R552.2 R558.2 R564.2 U15.2(VIN) U16.2(VIN) U17.2(VIN)
VCCIN: C406.2 C407.2 C408.2 C409.2 R569.2 U18.2(VIN)
NetC372_1: C372.1 D7.2(K) L13.1 U15.8(SW)
NetC372_2: C372.2 U15.1(BOOT)
NetC377_2: C377.2 C378.2 C379.2 C380.2 C381.2 FB17.1 FB18.1 L13.2 R555.1
NetC382_2: C382.2 U15.6(SS)
NetC383_1: C383.1 D8.2(K) L14.1 U16.8(SW)
NetC383_2: C383.2 U16.1(BOOT)
NetC388_2: C388.2 C389.2 C390.2 C391.2 C392.2 FB19.1 FB20.1 L14.2 R561.1
NetC393_2: C393.2 U16.6(SS)
NetC394_1: C394.1 D9.2(K) L15.1 U17.8(SW)
NetC394_2: C394.2 U17.1(BOOT)
NetC399_2: C399.2 C400.2 C401.2 C402.2 C403.2 FB21.1 FB22.1 L15.2 R566.1
NetC404_2: C404.2 U17.6(SS)
NetC405_1: C405.1 D10.2(K) L16.1 U18.8(SW)
NetC405_2: C405.2 U18.1(BOOT)
NetC410_2: C410.2 C411.2 C412.2 C413.2 C414.2 FB23.1 FB24.1 L16.2 R572.1
NetC415_2: C415.2 U18.6(SS)
NetLED48_1: LED48.1 R553.2
NetLED49_1: LED49.1 R559.2
NetLED50_1: LED50.1 R570.2
NetR552_1: R552.1 R554.1 U15.3(EN)
NetR555_2: R555.2 R557.1 U15.5(FB)
NetR556_1: R556.1 U15.4(RT/SYNC)
NetR558_1: R558.1 R560.1 U16.3(EN)
NetR561_2: R561.2 R563.1 U16.5(FB)
NetR562_1: R562.1 U16.4(RT/SYNC)
NetR564_1: R564.1 R565.1 U17.3(EN)
NetR566_2: R566.2 R568.1 U17.5(FB)
NetR567_1: R567.1 U17.4(RT/SYNC)
NetR569_1: R569.1 R571.1 U18.3(EN)
NetR572_2: R572.2 R574.1 U18.5(FB)
NetR573_1: R573.1 U18.4(RT/SYNC)

### Notes on the sheet
- (near U15) Rb=10K
- Rt=[(Vout - 0.75) / 0.75]*Rb
- Vout=(Rt * 0.75)/Rb + 0.75
- (near U16) Rb=10K
- (near U17) Rb=10K
- (near U18) Rb=10K
- (in symbol TitleBlock0) Title; Size; Document Number; Rev; Date:; Sheet; of

### Library data of the parts
*#11 = TitleBlock0: as *#10 on sheet 15-PWR_1; Page Size: =PageSize; Page Create Date: March  8, 1995; Page Modify Date: =ModifiedDate
C372-C415 = CAP: Capacitor; Value: 100pF; Published: 8-Jun-2000; Revision: July-2002: Re-released for DXP Platform.; Publisher: Altium Limited
D7-D10 = SB1045L_C908747: as D2 on sheet 15-PWR_1; Symbol: SB1045L_C908747; Device: SB1045L_C908747; LCSC Part Name: 电压:45V 电流:10A; Supplier Part: C908747; Manufacturer Part: SB1045L; Supplier Footprint: TO-277; JLCPCB Part Class: Extended Part; Datasheet: https://atta.szlcsc.com/upload/public/pdf/source/20210105/C908747_DE348528BC53D9CC51537B568EB9903F.pdf; Supplier: LCSC; Convert to PCB: yes; Comment_1: SB1045L
FB17-FB24 = Inductor: as FB16 on sheet 14-RTL8367; Published: 8-Jun-2000; LatestRevisionDate: 29-May-2009; LatestRevisionNote: IPC-7351 Footprint Added.; PackageReference: 0402-A; Publisher: Altium Limited; PackageDescription: Chip Inductor; Code_JEITA: 0402
L13-L16 = Inductor: as L17 on sheet 15-PWR_1; Published: 8-Jun-2000; LatestRevisionDate: 29-May-2009; LatestRevisionNote: IPC-7351 Footprint Added.; PackageReference: 0402-A; Publisher: Altium Limited; PackageDescription: Chip Inductor; Code_JEITA: 0402
LED48-LED50 = LED
R552 R554-R558 R560-R569 R571-R574 = Res Semi: Semiconductor Resistor; Value: 240R; Published: 8-Jun-2000; LatestRevisionDate: 17-Jul-2002; LatestRevisionNote: Re-released for DXP Platform.; PackageReference: AXIAL-0.5; Publisher: Altium Limited; PackageDescription: Axial Device, Thru-Hole; 2 Leads; 0.5 in Pin Spacing
R553 R559 R570 = Res Semi: Semiconductor Resistor; Value: 1K; Published: 8-Jun-2000; LatestRevisionDate: 17-Jul-2002; LatestRevisionNote: Re-released for DXP Platform.; PackageReference: AXIAL-0.5; Publisher: Altium Limited; PackageDescription: Axial Device, Thru-Hole; 2 Leads; 0.5 in Pin Spacing
U15-U18 = LMR14030